# EAGLE design fsdr (EAGLE 6.3)

## Sheet 1 of 2
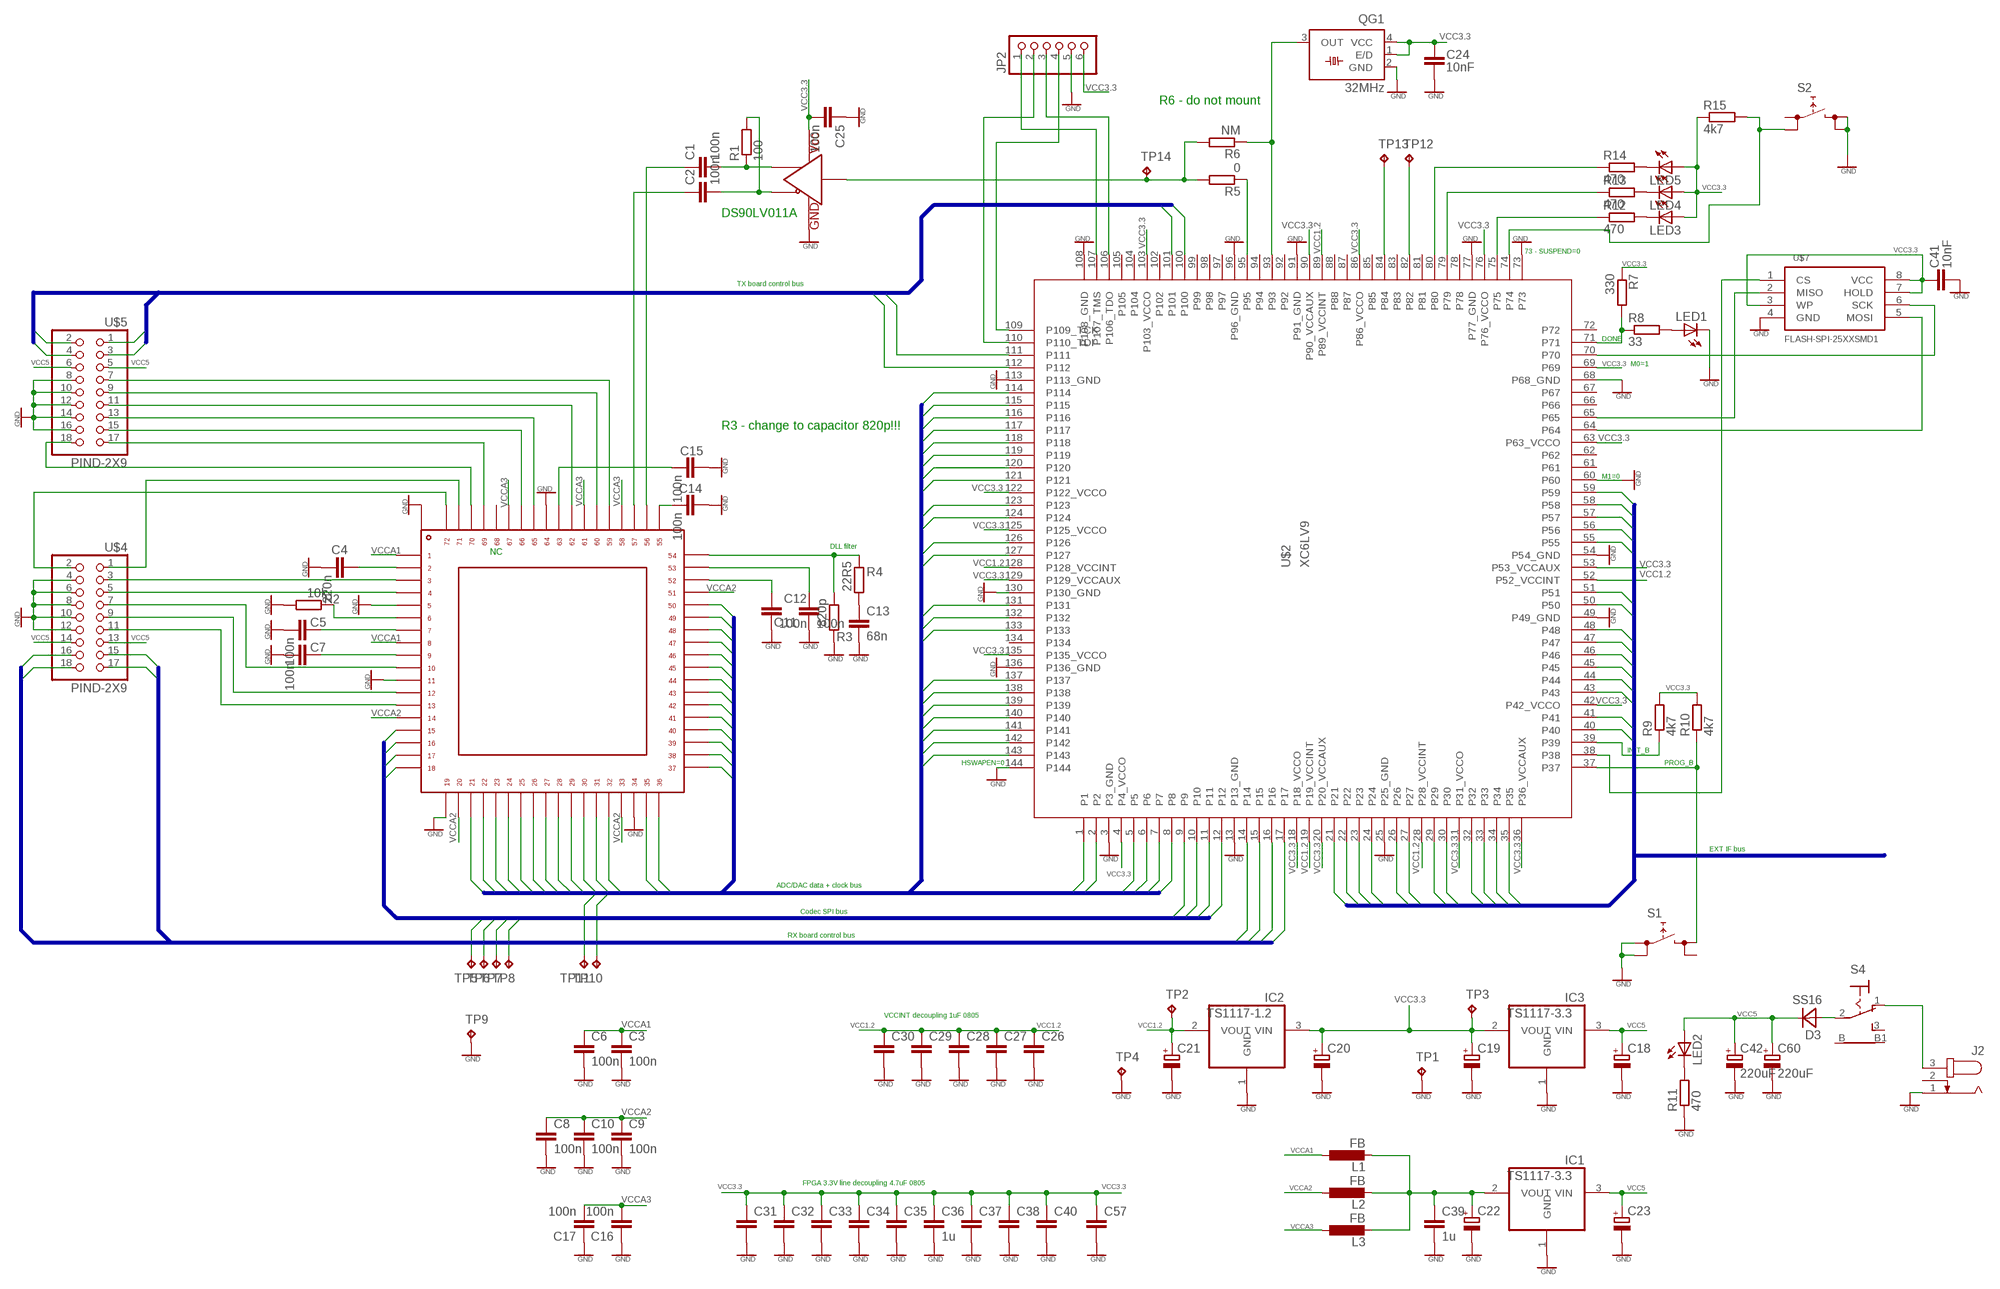
[diagram p0: schematic, sheet 1]

### Parts
C1  100n  C-EUC0402  [C0402]
C2  100n  C-EUC0402  [C0402]
C3  100n  C-EUC0402  [C0402]
C4  220n  C-EUC0402  [C0402]
C5  100n  C-EUC0402  [C0402]
C6  100n  C-EUC0402  [C0402]
C7  100n  C-EUC0402  [C0402]
C8  100n  C-EUC0402  [C0402]
C9  100n  C-EUC0402  [C0402]
C10  100n  C-EUC0402  [C0402]
C11  100n  C-EUC0402  [C0402]
C12  100n  C-EUC0402  [C0402]
C13  68n  C-EUC0402  [C0402]
C14  100n  C-EUC0402  [C0402]
C15  100n  C-EUC0402  [C0402]
C16  100n  C-EUC0402  [C0402]
C17  100n  C-EUC0402  [C0402]
C18  CPOL-EUSMCA  [SMC_A]
C19  CPOL-EUSMCA  [SMC_A]
C20  CPOL-EUSMCA  [SMC_A]
C21  CPOL-EUSMCA  [SMC_A]
C22  CPOL-EUSMCA  [SMC_A]
C23  CPOL-EUSMCA  [SMC_A]
C24  10nF  C-EUC0402  [C0402]
C25  100n  C-EUC0402  [C0402]
C26  C-EUC0805  [C0805]
C27  C-EUC0805  [C0805]
C28  C-EUC0805  [C0805]
C29  C-EUC0805  [C0805]
C30  C-EUC0805  [C0805]
C31  C-EUC0805  [C0805]
C32  C-EUC0805  [C0805]
C33  C-EUC0805  [C0805]
C34  C-EUC0805  [C0805]
C35  C-EUC0805  [C0805]
C36  1u  C-EUC0805  [C0805]
C37  C-EUC0805  [C0805]
C38  C-EUC0805  [C0805]
C39  1u  C-EUC0805  [C0805]
C40  C-EUC0805  [C0805]
C41  10nF  C-EUC0402  [C0402]
C42  220uF  CPOL-EUSMCD  [SMC_D]
C57  C-EUC0805  [C0805]
C60  220uF  CPOL-EUSMCD  [SMC_D]
D3  SS16  MBRA340T3  [SMA]
IC1  TS1117-3.3  REG1117  [SOT223]
IC2  TS1117-1.2  REG1117  [SOT223]
IC3  TS1117-3.3  REG1117  [SOT223]
J2  JACK-PLUG  [SPC4078-NOSLOT]
JP2  PINHD-1X6  [1X06]
L1  FB  EMI_FB-0603  [C0603]
L2  FB  EMI_FB-0603  [C0603]
L3  FB  EMI_FB-0603  [C0603]
LED1  LEDSML0805  [SML0805]
LED2  LEDSML0805  [SML0805]
LED3  LEDSML0805  [SML0805]
LED4  LEDSML0805  [SML0805]
LED5  LEDSML0805  [SML0805]
QG1  32MHz  SM77H  [SM77H]
R1  100  R-EU_R0402  [R0402]
R2  10k  R-EU_R0402  [R0402]
R3  820p  R-EU_R0402  [R0402]
R4  22R5  R-EU_R0402  [R0402]
R5  0  R-EU_R0402  [R0402]
R6  NM  R-EU_R0402  [R0402]
R7  330  R-EU_R0402  [R0402]
R8  33  R-EU_R0402  [R0402]
R9  4k7  R-EU_R0402  [R0402]
R10  4k7  R-EU_R0402  [R0402]
R11  470  R-EU_R0402  [R0402]
R12  470  R-EU_R0402  [R0402]
R13  470  R-EU_R0402  [R0402]
R14  470  R-EU_R0402  [R0402]
R15  4k7  R-EU_R0402  [R0402]
S1  SKHMPSE010  [SKHMPXE010]
S2  SKHMPSE010  [SKHMPXE010]
S4  9070-1W  [9070-1W]
TP1  TPPAD1-13  [P1-13]
TP2  TPPAD1-13  [P1-13]
TP3  TPPAD1-13  [P1-13]
TP4  TPPAD1-13  [P1-13]
TP5  TPB1,27  [B1,27]
TP6  TPB1,27  [B1,27]
TP7  TPB1,27  [B1,27]
TP8  TPB1,27  [B1,27]
TP9  TPB1,27  [B1,27]
TP10  TPB1,27  [B1,27]
TP11  TPB1,27  [B1,27]
TP12  TPB1,27  [B1,27]
TP13  TPB1,27  [B1,27]
TP14  TPB1,27  [B1,27]
U$1  AD9963  [LFCSP72]
U$2  XC6LV9  [TQFP144]
U$3  DS90LV011a  DS90LV011  [SOT23-5L]
U$4  PIND-2X9  [2X9SMD]
U$5  PIND-2X9  [2X9SMD]
U$7  FLASH-SPI-25XXSMD1  [SO08-EIAJ]

### Nets
CS: TP7.TP U$1.P$17 U$2.10
GND: C3.2 C4.2 C5.2 C6.2 C7.2 C8.2 C9.2 C10.2 C11.2 C12.2 C13.2 C14.1 C15.1 C16.1 C17.1 C18.- C19.- C20.- C21.- C22.- C23.- C24.1 C25.1 C26.2 C27.2 C28.2 C29.2 C30.2 C31.2 C32.2 C33.2 C34.2 C35.2 C36.2 C37.2 C38.2 C39.2 C40.2 C41.1 C42.- C57.2 C60.- IC1.1(GND) IC2.1(GND) IC3.1(GND) J2.1 JP2.5 LED1.C QG1.2(GND) R2.2 R3.2 R11.1 S1.1(1.1) S1.2(1.2) S2.3(2.1) S2.4(2.2) TP1.TP TP4.TP TP9.TP U$1.P$5 U$1.P$11 U$1.P$19 U$1.P$34 U$1.P$64 U$1.P$73_PAD U$2.3(P3_GND) U$2.13(P13_GND) U$2.25(P25_GND) U$2.49(P49_GND) U$2.54(P54_GND) U$2.60 U$2.68(P68_GND) U$2.73 U$2.77(P77_GND) U$2.91(P91_GND) U$2.96(P96_GND) U$2.108(P108_GND) U$2.113(P113_GND) U$2.130(P130_GND) U$2.136(P136_GND) U$2.144 U$3.2(GND) U$4.4 U$4.6 U$4.8 U$4.10 U$4.12 U$5.8 U$5.10 U$5.12 U$5.14 U$5.16 U$7.4(GND) ; also sheet 2
N$1: R7.2 R8.1 U$2.71
N$2: QG1.3(OUT) R6.1 U$2.93
N$3: LED1.A R8.2
N$4: JP2.1 U$2.107(P107_TMS)
N$5: JP2.3 U$2.106(P106_TDO)
N$6: JP2.4 U$2.109(P109_TCK)
N$7: JP2.2 U$2.110(P110_TDI)
N$8: R10.1 S1.3(2.1) U$2.37
N$9: U$1.P$3 U$4.3
N$10: U$1.P$4 U$4.5
N$11: U$1.P$10 U$4.7
N$12: U$1.P$12 U$4.9
N$13: C7.1 U$1.P$9
N$14: U$1.P$72 U$4.2
N$15: U$1.P$71 U$4.1
N$16: U$1.P$70 U$5.18
N$17: U$1.P$69 U$5.17
N$18: U$1.P$66 U$5.15
N$19: U$1.P$65 U$5.13
N$20: U$1.P$62 U$5.11
N$21: U$1.P$60 U$5.9
N$22: U$1.P$59 U$5.7
N$23: C1.2 R1.1 U$3.4(OUT)
N$24: C2.2 R1.2 U$3.3(/OUT)
N$25: C2.1 U$1.P$57
N$26: C13.1 R4.2
N$27: C1.1 U$1.P$56
N$28: R9.1 U$2.39
N$29: U$1.P$13 U$4.11
N$31: R2.1 U$1.P$6
N$32: C5.1 U$1.P$7
N$33: C4.1 U$1.P$2
N$34: C14.2 U$1.P$55
N$35: C15.2 U$1.P$63
N$36: R3.1 R4.1 U$1.P$54
N$37: C12.1 U$1.P$53
N$38: C11.1 U$1.P$52
N$39: R5.2 R6.2 TP14.TP U$3.5(IN)
N$41: R5.1 U$2.95
N$42: TP12.TP U$2.82
N$43: TP13.TP U$2.84
N$45: D3.A S4.2(P)
N$46: LED2.C R11.2
N$48: C22.+ C39.1 IC1.2(VOUT) L1.2 L2.2 L3.2
N$50: J2.3 S4.1(O)
N$51: U$2.38 U$7.1(CS)
N$53: U$2.64 U$7.5(MOSI)
N$54: U$2.70 U$7.6(SCK)
N$55: U$2.65 U$7.2(MISO)
N$56: R12.1 U$2.75
N$60: LED3.C R12.2
N$61: LED4.C R13.2
N$62: LED5.C R14.2
N$63: R13.1 U$2.79
N$65: R14.1 U$2.80
N$67: R15.2 S2.2(1.2) U$2.74
P14: U$2.14 U$4.16
P15: U$2.15 U$4.15
P16: U$2.16 U$4.18
P17: U$2.17 U$4.17
P21: U$2.21 ; also sheet 2
P22: U$2.22 ; also sheet 2
P23: U$2.23 ; also sheet 2
P24: U$2.24 ; also sheet 2
P26: U$2.26 ; also sheet 2
P27: U$2.27 ; also sheet 2
P29: U$2.29 ; also sheet 2
P30: U$2.30 ; also sheet 2
P32: U$2.32 ; also sheet 2
P33: U$2.33 ; also sheet 2
P34: U$2.34 ; also sheet 2
P35: U$2.35 ; also sheet 2
P40: U$2.40 ; also sheet 2
P41: U$2.41 ; also sheet 2
P43: U$2.43 ; also sheet 2
P44: U$2.44 ; also sheet 2
P45: U$2.45 ; also sheet 2
P46: U$2.46 ; also sheet 2
P47: U$2.47 ; also sheet 2
P48: U$2.48 ; also sheet 2
P50: U$2.50 ; also sheet 2
P51: U$2.51 ; also sheet 2
P55: U$2.55 ; also sheet 2
P56: U$2.56 ; also sheet 2
P57: U$2.57 ; also sheet 2
P58: U$2.58 ; also sheet 2
P59: U$2.59 ; also sheet 2
P100: U$2.100 U$5.2
P101: U$2.101 U$5.1
P111: U$2.111 U$5.4
P112: U$2.112 U$5.3
RES: TP5.TP U$1.P$15 U$2.12
SCK: TP6.TP U$1.P$16 U$2.11
SD: TP8.TP U$1.P$18 U$2.9
TRXCLK: TP11.TP U$1.P$36 U$2.133
TRXD0: U$1.P$32 U$2.138
TRXD1: U$1.P$31 U$2.139
TRXD2: U$1.P$30 U$2.140
TRXD3: U$1.P$29 U$2.141
TRXD4: U$1.P$28 U$2.142
TRXD5: U$1.P$27 U$2.143
TRXD6: U$1.P$26 U$2.1
TRXD7: U$1.P$25 U$2.2
TRXD8: U$1.P$24 U$2.5
TRXD9: U$1.P$23 U$2.6
TRXD10: U$1.P$22 U$2.7
TRXD11: U$1.P$21 U$2.8
TRXIQ: U$1.P$35 U$2.137
TXCLK: TP10.TP U$1.P$37 U$2.132
TXD0: U$1.P$50 U$2.114
TXD1: U$1.P$49 U$2.115
TXD2: U$1.P$48 U$2.116
TXD3: U$1.P$47 U$2.117
TXD4: U$1.P$46 U$2.118
TXD5: U$1.P$45 U$2.119
TXD6: U$1.P$44 U$2.120
TXD7: U$1.P$43 U$2.121
TXD8: U$1.P$42 U$2.123
TXD9: U$1.P$41 U$2.124
TXD10: U$1.P$40 U$2.126
TXD11: U$1.P$39 U$2.127
TXIQ: U$1.P$38 U$2.131
VCC1.2: C21.+ C26.1 C27.1 C28.1 C29.1 C30.1 IC2.2(VOUT) TP2.TP U$2.19(P19_VCCINT) U$2.28(P28_VCCINT) U$2.52(P52_VCCINT) U$2.89(P89_VCCINT) U$2.128(P128_VCCINT)
VCC3.3: C19.+ C20.+ C24.2 C25.2 C31.1 C32.1 C33.1 C34.1 C35.1 C36.1 C37.1 C38.1 C40.1 C41.2 C57.1 IC2.3(VIN) IC3.2(VOUT) JP2.6 LED3.A LED4.A LED5.A QG1.1(E/D) QG1.4(VCC) R7.1 R9.2 R10.2 R15.1 TP3.TP U$2.4(P4_VCCO) U$2.18(P18_VCCO) U$2.20(P20_VCCAUX) U$2.31(P31_VCCO) U$2.36(P36_VCCAUX) U$2.42(P42_VCCO) U$2.53(P53_VCCAUX) U$2.63(P63_VCCO) U$2.69 U$2.76(P76_VCCO) U$2.86(P86_VCCO) U$2.90(P90_VCCAUX) U$2.103(P103_VCCO) U$2.122(P122_VCCO) U$2.125(P125_VCCO) U$2.129(P129_VCCAUX) U$2.135(P135_VCCO) U$3.1(VCC) U$7.3(WP) U$7.7(HOLD) U$7.8(VCC)
VCC5: C18.+ C23.+ C42.+ C60.+ D3.C IC1.3(VIN) IC3.3(VIN) LED2.A U$4.13 U$4.14 U$5.5 U$5.6 ; also sheet 2
VCCA1: C3.1 C6.1 L1.1 U$1.P$1 U$1.P$8
VCCA2: C8.1 C9.1 C10.1 L2.1 U$1.P$14 U$1.P$20 U$1.P$33 U$1.P$51
VCCA3: C16.2 C17.2 L3.1 U$1.P$58 U$1.P$61 U$1.P$67
Unconnected: J2.2 S1.4(2.2) S2.1(1.1) S4.3(S) S4.B S4.B1 U$1.P$68 U$2.62 U$2.66 U$2.67 U$2.72 U$2.78 U$2.81 U$2.83 U$2.87 U$2.92 U$2.94 U$2.97 U$2.99 U$2.102 U$2.104 U$2.105 U$2.134

### Buses
RES,SCK,CS,SD
TRXD[0..11],TRXCLK,TRXIQ,TXD[0..11],TXIQ,TXCLK
P[21..24],P26,P27,P29,P30,P[32..35],P40,P41,P[43..48],P50,P51,P[55..59]
P[14..17]
P101,P100,P111,P112

### Notes on the sheet
- R6 - do not mount
- DS90LV011A
- 73 - SUSPEND=0
- TX board control bus
- DONE
- M0=1
- R3 - change to capacitor 820p!!!
- M1=0
- NC | DLL filter
- INIT_B
- HSWAPEN=0 | PROG_B
- EXT IF bus
- ADC/DAC data + clock bus
- Codec SPI bus
- RX board control bus
- VCCINT decoupling 1uF 0805
- FPGA 3.3V line decoupling 4.7uF 0805

## Sheet 2 of 2
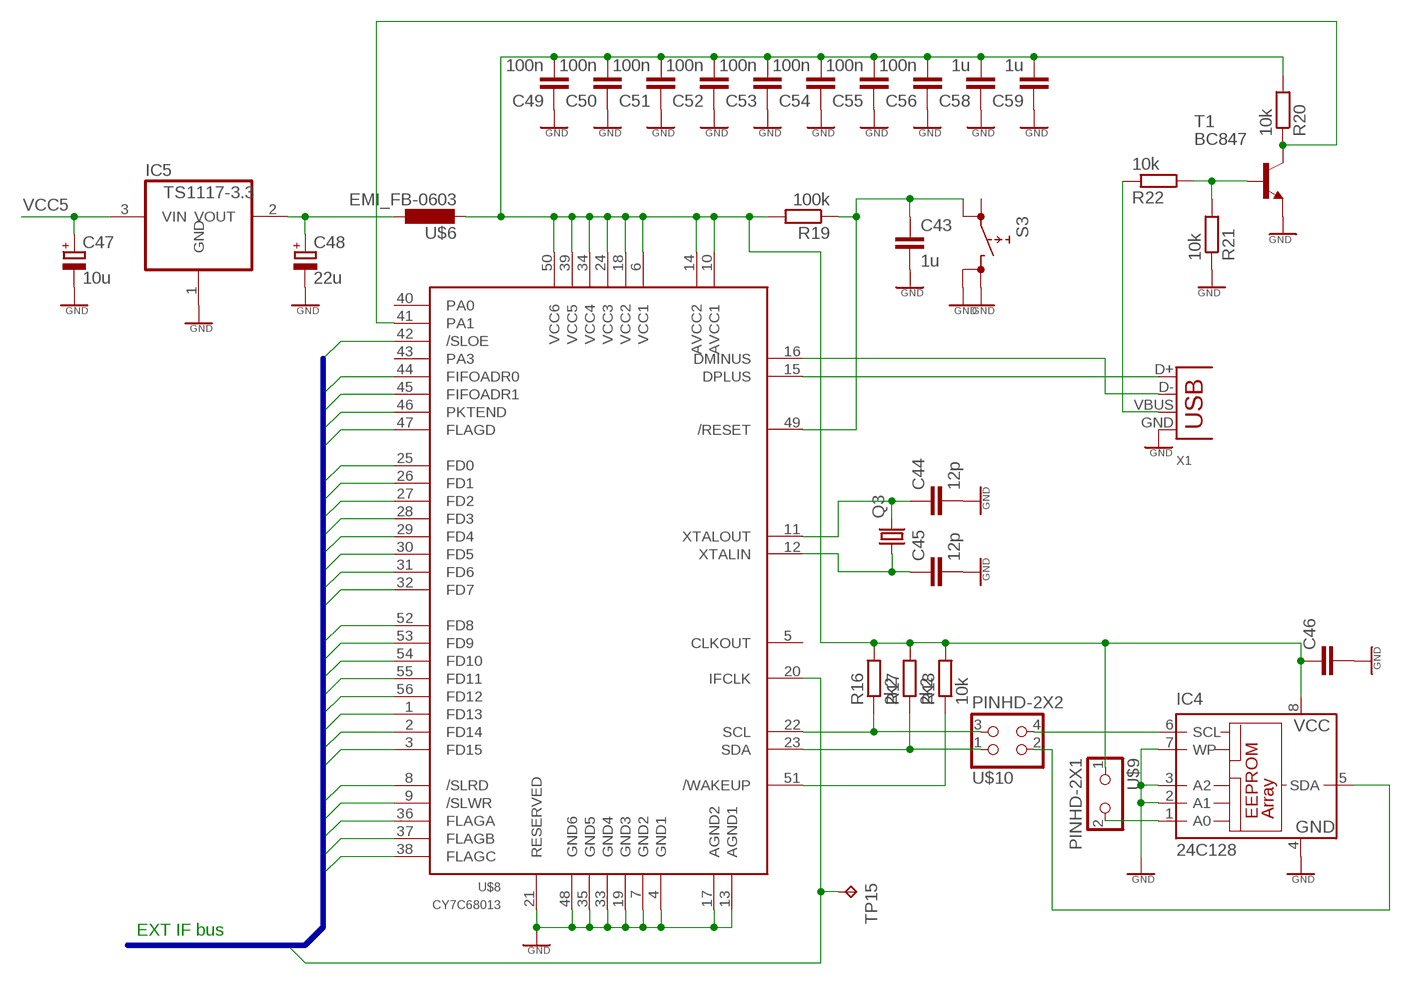
[diagram p1: schematic, sheet 2]

### Parts
C43  1u  C-EUC0402  [C0402]
C44  12p  C-EUC0402  [C0402]
C45  12p  C-EUC0402  [C0402]
C46  C-EUC0402  [C0402]
C47  10u  CPOL-EUSMCA  [SMC_A]
C48  22u  CPOL-EUSMCA  [SMC_A]
C49  100n  C-EUC0402  [C0402]
C50  100n  C-EUC0402  [C0402]
C51  100n  C-EUC0402  [C0402]
C52  100n  C-EUC0402  [C0402]
C53  100n  C-EUC0402  [C0402]
C54  100n  C-EUC0402  [C0402]
C55  100n  C-EUC0402  [C0402]
C56  100n  C-EUC0402  [C0402]
C58  1u  C-EUC0402  [C0402]
C59  1u  C-EUC0402  [C0402]
IC4  24C128  24C16BSN  [SO-08]
IC5  TS1117-3.3  REG1117  [SOT223]
Q3  CRYSTALHC49U-V  [HC49U-V]
R16  2k2  R-EU_R0402  [R0402]
R17  2k2  R-EU_R0402  [R0402]
R18  10k  R-EU_R0402  [R0402]
R19  100k  R-EU_R0402  [R0402]
R20  10k  R-EU_R0402  [R0402]
R21  10k  R-EU_R0402  [R0402]
R22  10k  R-EU_R0402  [R0402]
S3  SKHMPSE010  [SKHMPXE010]
T1  BC847  [SOT23]
TP15  TPB1,27  [B1,27]
U$6  EMI_FB-0603  [C0603]
U$8  CY7C68013  [56-SSOP]
U$9  PINHD-2X1  [2X1SMD]
U$10  PINHD-2X2  [2X2SMD]
X1  USB-MB-S  [USB-MB-S]

### Nets
GND: C43.2 C44.2 C45.2 C46.2 C47.- C48.- C49.1 C50.1 C51.1 C52.1 C53.1 C54.1 C55.1 C56.1 C58.1 C59.1 IC4.2(A1) IC4.3(A2) IC4.4(GND) IC4.7(WP) IC5.1(GND) R21.1 S3.3(2.1) S3.4(2.2) T1.2(E) U$8.4(GND1) U$8.7(GND2) U$8.13(AGND1) U$8.17(AGND2) U$8.19(GND3) U$8.21(RESERVED) U$8.33(GND4) U$8.35(GND5) U$8.48(GND6) X1.GND ; also sheet 1
N$47: U$8.15(DPLUS) X1.D+
N$49: U$8.16(DMINUS) X1.D-
N$52: C43.1 R19.1 S3.2(1.2) U$8.49(/RESET)
N$57: R16.1 U$8.22(SCL) U$10.3
N$58: IC4.5(SDA) U$10.2
N$59: R18.1 U$8.51(/WAKEUP)
N$64: C44.1 Q3.2 U$8.11(XTALOUT)
N$66: C45.1 Q3.1 U$8.12(XTALIN)
N$68: C46.1 C49.2 C50.2 C51.2 C52.2 C53.2 C54.2 C55.2 C56.2 C58.2 C59.2 IC4.8(VCC) R16.2 R17.2 R18.2 R19.2 R20.2 U$6.2 U$8.6(VCC1) U$8.10(AVCC1) U$8.14(AVCC2) U$8.18(VCC2) U$8.24(VCC3) U$8.34(VCC4) U$8.39(VCC5) U$8.50(VCC6) U$9.1
N$69: IC4.1(A0) U$9.2
N$70: C48.+ IC5.2(VOUT) U$6.1
N$71: R22.1 X1.VBUS
N$72: R17.1 U$8.23(SDA) U$10.1
N$73: IC4.6(SCL) U$10.4
N$74: R20.1 T1.3(C) U$8.41(PA1)
N$75: R21.2 R22.2 T1.1(B)
P21: U$8.56(FD12) ; also sheet 1
P22: U$8.55(FD11) ; also sheet 1
P23: U$8.54(FD10) ; also sheet 1
P24: U$8.53(FD9) ; also sheet 1
P26: U$8.52(FD8) ; also sheet 1
P27: U$8.47(FLAGD) ; also sheet 1
P29: U$8.46(PKTEND) ; also sheet 1
P30: U$8.45(FIFOADR1) ; also sheet 1
P32: U$8.44(FIFOADR0) ; also sheet 1
P33: U$8.42(/SLOE) ; also sheet 1
P34: U$8.38(FLAGC) ; also sheet 1
P35: U$8.37(FLAGB) ; also sheet 1
P40: U$8.29(FD4) ; also sheet 1
P41: U$8.30(FD5) ; also sheet 1
P43: U$8.31(FD6) ; also sheet 1
P44: U$8.32(FD7) ; also sheet 1
P45: U$8.36(FLAGA) ; also sheet 1
P46: U$8.27(FD2) ; also sheet 1
P47: U$8.28(FD3) ; also sheet 1
P48: U$8.26(FD1) ; also sheet 1
P50: U$8.25(FD0) ; also sheet 1
P51: TP15.TP U$8.20(IFCLK) ; also sheet 1
P55: U$8.9(/SLWR) ; also sheet 1
P56: U$8.8(/SLRD) ; also sheet 1
P57: U$8.3(FD15) ; also sheet 1
P58: U$8.2(FD14) ; also sheet 1
P59: U$8.1(FD13) ; also sheet 1
VCC5: C47.+ IC5.3(VIN) ; also sheet 1
Unconnected: S3.1(1.1) U$8.5(CLKOUT) U$8.40(PA0) U$8.43(PA3)

### Buses
P[21..24],P26,P27,P29,P30,P[32..35],P40,P41,P[43..48],P50,P51,P[55..59]

### Notes on the sheet
- EXT IF bus

## Power pins joined to a net without a drawn wire
P61: U$2.61
P85: U$2.85
P88: U$2.88
P98: U$2.98

## Library data of the parts
C1-C17 C24-C41 C43-C46 C49-C59 = rcl:C-EU: CAPACITOR, European symbol
C18-C23 C42 C47 C48 C60 = rcl:CPOL-EU: POLARIZED CAPACITOR, European symbol
D3 = diode:MBRA340T3: Surface Mount Schottky Power Rectifier Source: http://www.onsemi.com/pub_link/Collateral/MBRA340T3-D.PDF
IC1-IC3 IC5 = burr-brown:REG1117: 800mA and 1A Low Dropout (LDO) Positive Regulator 1.8V, 2.5V, 2.85V, 3.3V, 5V, and Adj; MPN: REG1117; OC_FARNELL: 1097566; OC_NEWARK: 14P6981
IC4 = microchip:24*: Serial EEPROM I2C; MPN: AT24C16BN-SH-B; OC_FARNELL: 1362651; OC_NEWARK: 50M3324
J2 = GadgetFactory:JACK-PLUG: DC POWER JACK Power Jack, DC, Right Angle, Through Hole, Rated 5A at 16VDC, PC Terminals Distributor: Farnell (www.Farnell.de) Drawing: 84N1161.pdf / 84N1162.pdf Manufacturer: SPC Technology (www.spctechnology.com) Type: SPC4077 / SPC 4078
JP2 = pinhead:PINHD-1X6: PIN HEADER
L1-L3 U$6 = emi_fb:EMI_FB-0603
LED1-LED5 = led:LED: LED OSRAM: - CHIPLED LG R971, LG N971, LY N971, LG Q971, LY Q971, LO R971, LY R971 LH N974, LH R974 LS Q976, LO Q976, LY Q976 LO Q996 - Hyper CHIPLED LW Q18S LB Q993, LB Q99A, LB R99A - SideLED LS A670, LO A670, LY A670, LG A670, LP A670 LB A673, LV A673, LT A673, LW A673 LH A674 LY A675 LS A676, LA A676, LO A676, LY A676, LW A676 LS A679, LY A679, LG A679 - Hyper Micro SIDELED® LS Y876, LA Y876, LO Y876, LY Y876 LT Y87S - SmartLED LW L88C, LW L88S LB L89C, LB L89S, LG L890 LS L89K, LO L89K, LY L89K LS L896, LA L896, LO L896, LY L896 - TOPLED LS T670, LO T670, LY T670, LG T670, LP T670 LSG T670, LSP T670, LSY T670, LOP T670, LYG T670 LG T671, LOG T671, LSG T671 LB T673, LV T673, LT T673, LW T673 LH T674 LS T676, LA T676, LO T676, LY T676, LB T676, LH T676, LSB T676, LW T676 LB T67C, LV T67C, LT T67C, LS T67K, LO T67K, LY T67K, LW E67C LS E67B, LA E67B, LO E67B, LY E67B, LB E67C, LV E67C, LT E67C LW T67C LS T679, LY T679, LG T679 LS T770, LO T770, LY T770, LG T770, LP T770 LB T773, LV T773, LT T773, LW T773 LH T774 LS E675, LA E675, LY E675, LS T675 LS T776, LA T776, LO T776, LY T776, LB T776 LHGB T686 LT T68C, LB T68C - Hyper Mini TOPLED® LB M676 - Mini TOPLED Santana® LG M470 LS M47K, LO M47K, LY M47K Source: http://www.osram.convergy.de LUXEON: - LUMILED® LXK2-PW12-R00, LXK2-PW12-S00, LXK2-PW14-U00, LXK2-PW14-V00 LXK2-PM12-R00, LXK2-PM12-S00, LXK2-PM14-U00 LXK2-PE12-Q00, LXK2-PE12-R00, LXK2-PE12-S00, LXK2-PE14-T00, LXK2-PE14-U00 LXK2-PB12-K00, LXK2-PB12-L00, LXK2-PB12-M00, LXK2-PB14-N00, LXK2-PB14-P00, LXK2-PB14-Q00 LXK2-PR12-L00, LXK2-PR12-M00, LXK2-PR14-Q00, LXK2-PR14-R00 LXK2-PD12-Q00, LXK2-PD12-R00, LXK2-PD12-S00 LXK2-PH12-R00, LXK2-PH12-S00 LXK2-PL12-P00, LXK2-PL12-Q00, LXK2-PL12-R00 Source: www.luxeon.com KINGBRIGHT: KA-3528ASYC Source: www.kingbright.com
Q3 = crystal:CRYSTAL: CRYSTAL; OC_FARNELL: 1666969; OC_NEWARK: unknown
QG1 = crystal:SM77H: 3.3V CMOS Clock Oscillator Source: www.pletronics.com .. sm77h%203.3v.pdf; OC_FARNELL: unknown; OC_NEWARK: unknown
R1-R22 = rcl:R-EU_: RESISTOR, European symbol
S1-S3 = switch:SKHMP*E010: 6.2 X 6.5mm TACT Switch (SMD) Source: http://www3.alps.co.jp/WebObjects/catalog.woa/PDF/E/Switch/Tact/SKHM/SKHM.PDF
S4 = switch:9070-1W: TOGGLE SWITCH Marquardt
T1 = transistor:BC847: NPN TRANSISTOR
TP1-TP15 = testpad:TP: Test pad
U$1 = ad9963:AD9963
U$2 = spartan6:XC6LV9
U$3 = ds90lv011a:DS90LV011
U$4 U$5 = pinhead_2mm:PIND-2X9
U$7 = GadgetFactory:FLASH-SPI-25XX: SPI Flash
U$8 = cy7c68013:CY7C68013
U$9 = pinhead_2mm:PINHD-2X1
U$10 = pinhead_2mm:PINHD-2X2
X1 = con-usb-3:USB: USB Connectors

## Board
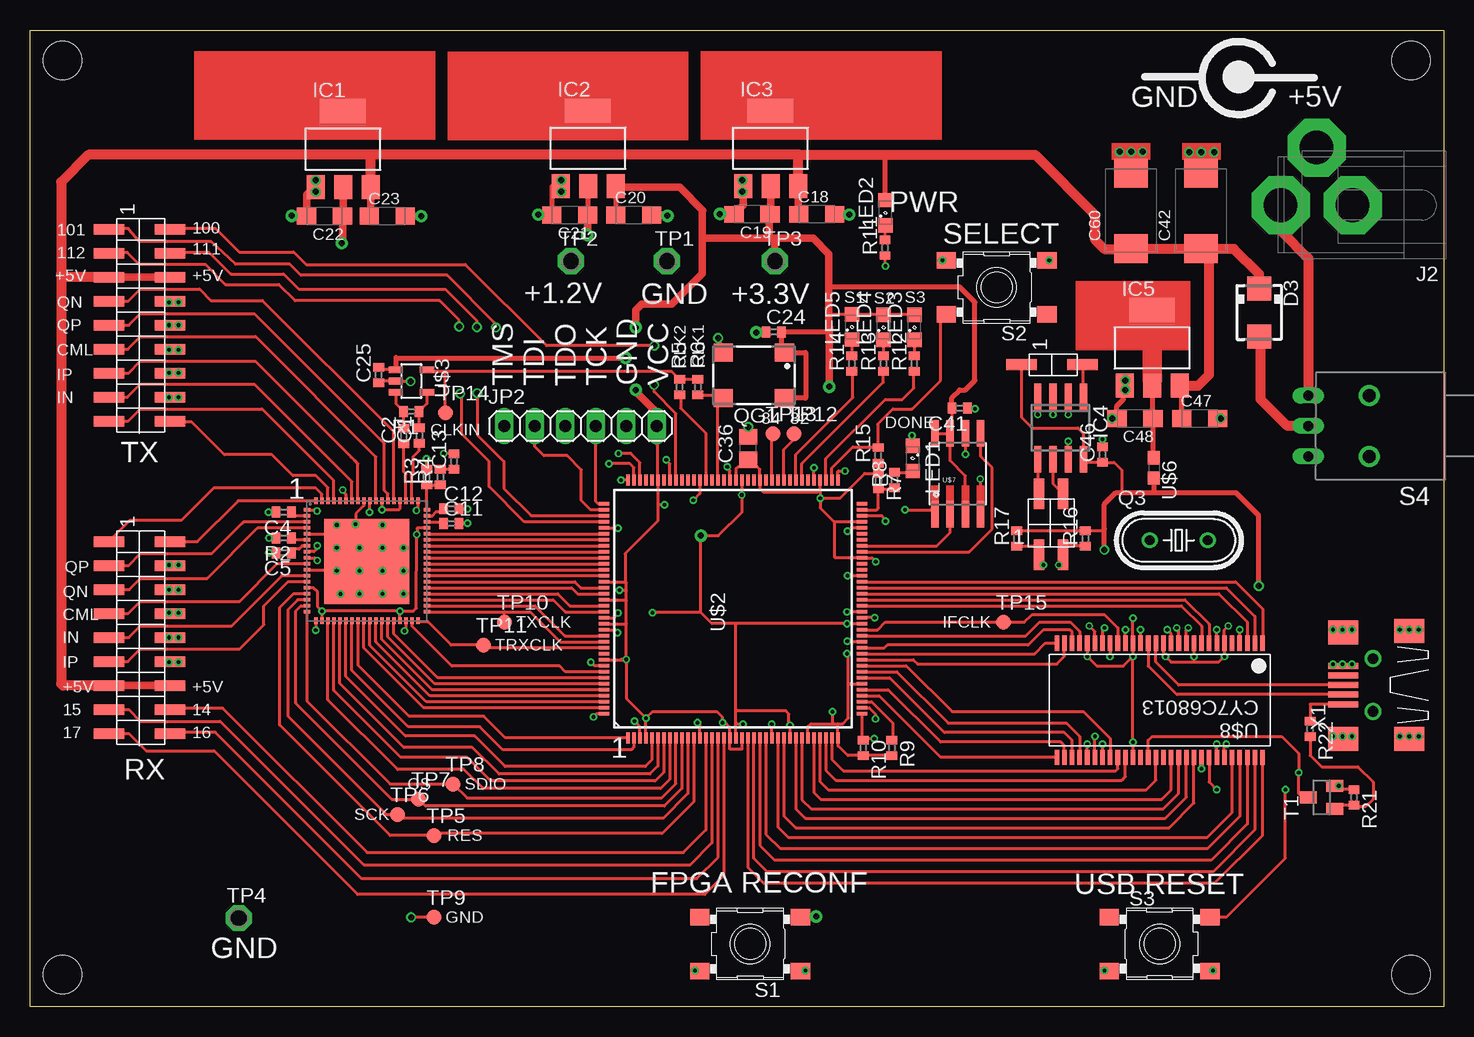
[diagram p2: board, top side]
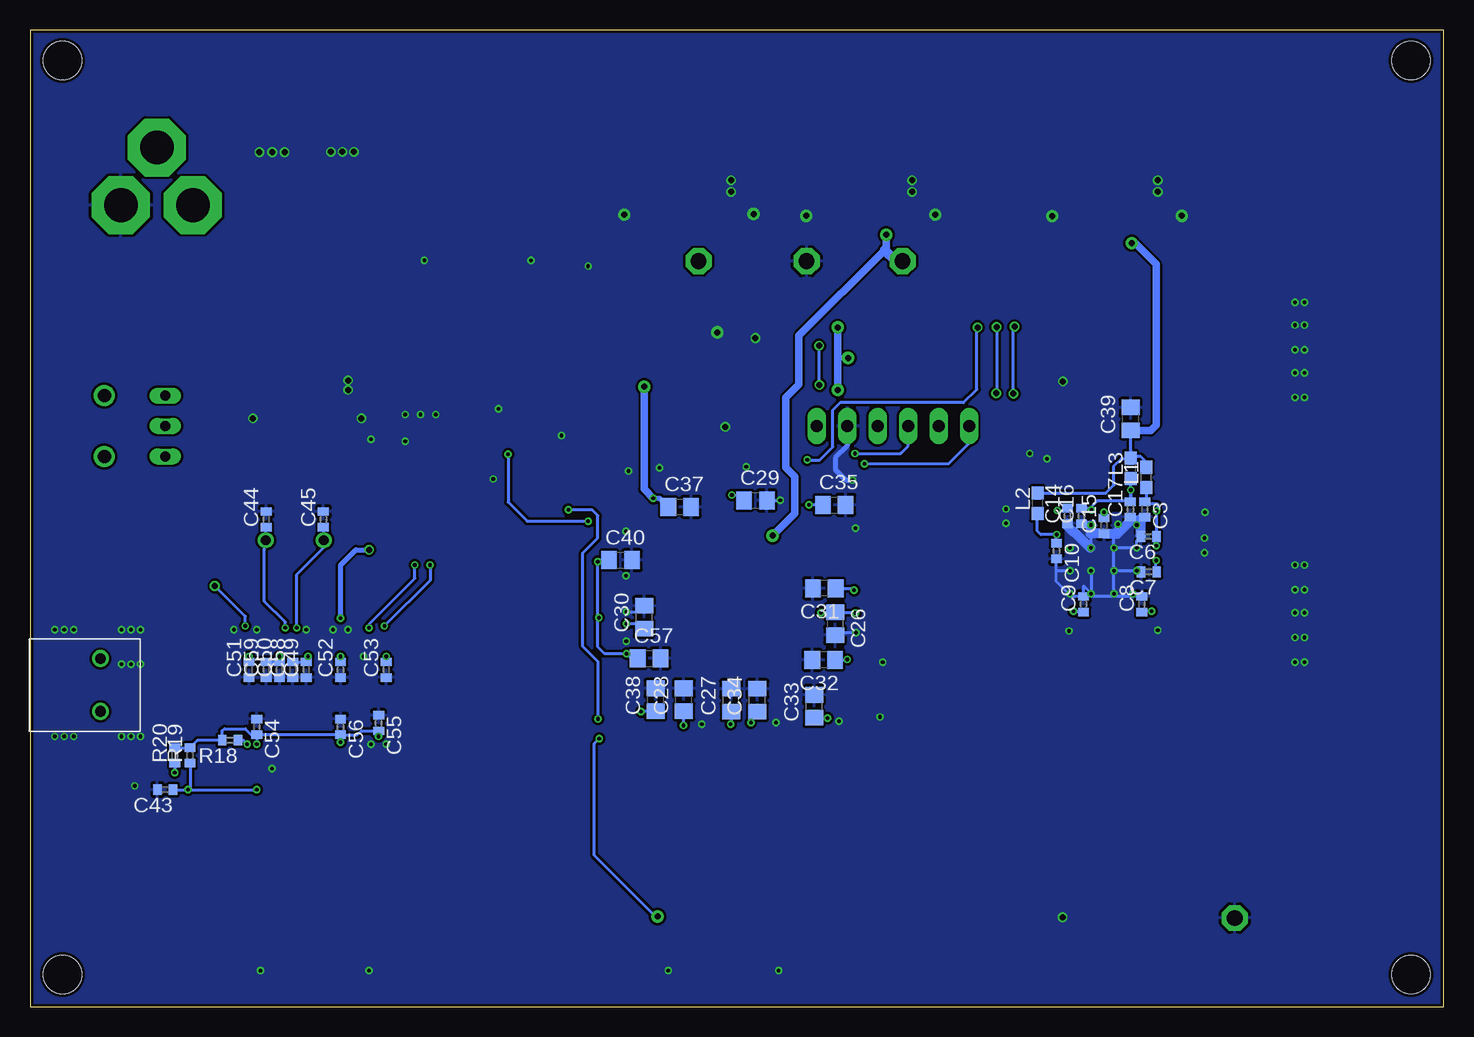
[diagram p3: board, bottom side, seen from below]

Size 117.79 x 81.44 mm. Coordinates in mm from the lower left corner, seen from the top.
Outline: 0,81.44 117.79,81.44 117.79,0 0,0 0,81.44
Copper layers (1*16): Top 0.035mm / dielectric 1.5mm / Bottom 0.035mm
Design rules "do_produkcji": minimum track width 6mil, minimum drill 12mil, track to track 8mil, track to pad 8mil, pad to pad 8mil, via to via 8mil, smd to smd 8mil, copper to edge 10mil, drill to drill 10mil, minimum pad ring 10mil, minimum via ring 6mil, stop-mask expansion 2mil, vias tented up to drill 100mil, thermal gap 10mil
Holes 3.2 mm at 115.09,78.9 115.09,2.7 2.7,2.7 2.7,78.9
bRestrict: area 26.7,41.3 to 28.1,41.9; area 31.6,37.8 to 31.9,40; area 31.9,39.7 to 33.5,43.3; area 24.1,39.7 to 24.8,40.3; area 28.9,40.6 to 29.5,41.1

### Footprints (pad centres in the part's own frame; a part is rotated, then mirrored left to right if it is on the bottom)
C0402 = smd 0.7 x 0.9: 1 -0.65,0; 2 0.65,0
SMC_A = smd 1.6 x 1.4: + -1.5,0; - 1.5,0
C0805 = smd 1.3 x 1.5: 1 -0.95,0; 2 0.95,0
SMC_D = smd 2.4 x 2.8: + -3.15,0; - 3.15,0
SMA = smd 2 x 2: A 2,0; C -2,0
SOT223 = smd 1.499 x 2.007: 1 -2.261,-3.15; 2 0.025,-3.15; 3 2.311,-3.15 | smd 3.81 x 2.007: 4 0,3.15
SO-08 = smd 0.6 x 2.2: 1 -1.905,-2.6; 2 -0.635,-2.6; 3 0.635,-2.6; 4 1.905,-2.6; 5 1.905,2.6; 6 0.635,2.6; 7 -0.635,2.6; 8 -1.905,2.6
SPC4078-NOSLOT = drill 2.8 pad 4.826 octagon: 1 -3,0; 2 0,-4.8; 3 3,0
1X06 = drill 1.016 long: 1 -6.35,0; 2 -3.81,0; 3 -1.27,0; 4 1.27,0; 5 3.81,0; 6 6.35,0
C0603 = smd 1.1 x 1: 1 -0.85,0; 2 0.85,0
SML0805 = smd 1.2 x 1.2: A 1.05,0; C -1.05,0
HC49U-V = drill 0.813: 1 -2.413,0; 2 2.413,0
SM77H = smd 1.6 x 1.5: 1 -2.55,-1.9; 2 2.55,-1.9; 3 2.55,1.9; 4 -2.55,1.9
R0402 = smd 0.7 x 0.9: 1 -0.65,0; 2 0.65,0
SKHMPXE010 = smd 1.6 x 1.4: 1 -4.2,2.25; 2 4.2,2.25; 3 -4.2,-2.25; 4 4.2,-2.25
9070-1W = drill 0.813 long: 1 5.08,-2.54; 2 5.08,0; 3 5.08,2.54 | drill 1.118 pad 1.778: B 0,-2.54; B1 0,2.54
SOT23 = smd 1 x 1.4: 1 -0.95,-1.1; 2 0.95,-1.1; 3 0,1.1
P1-13 = drill 1.321 pad 2.159 octagon: TP 0,0
B1,27 = smd 1.27 x 1.27: TP 0,0
LFCSP72 = smd 0.55 x 0.3: P$1 -5.07,4.38; P$2 -5.07,3.88; P$3 -5.07,3.38; P$4 -5.07,2.88; P$5 -5.07,2.38; P$6 -5.07,1.88; P$7 -5.07,1.38; P$8 -5.07,0.88; P$9 -5.07,0.38; P$10 -5.07,-0.12; P$11 -5.07,-0.62; P$12 -5.07,-1.12; P$13 -5.07,-1.62; P$14 -5.07,-2.12; P$15 -5.07,-2.62; P$16 -5.07,-3.12; P$17 -5.07,-3.62; P$18 -5.07,-4.12; P$37 4.93,-4.12; P$38 4.93,-3.62; P$39 4.93,-3.12; P$40 4.93,-2.62; P$41 4.93,-2.12; P$42 4.93,-1.62; P$43 4.93,-1.12; P$44 4.93,-0.62; P$45 4.93,-0.12; P$46 4.93,0.38; P$47 4.93,0.88; P$48 4.93,1.38; P$49 4.93,1.88; P$50 4.93,2.38; P$51 4.93,2.88; P$52 4.93,3.38; P$53 4.93,3.88; P$54 4.93,4.38 | smd 0.3 x 0.55: P$19 -4.33,-4.88; P$20 -3.83,-4.88; P$21 -3.33,-4.88; P$22 -2.83,-4.88; P$23 -2.33,-4.88; P$24 -1.83,-4.88; P$25 -1.33,-4.88; P$26 -0.83,-4.88; P$27 -0.33,-4.88; P$28 0.17,-4.88; P$29 0.67,-4.88; P$30 1.17,-4.88; P$31 1.67,-4.88; P$32 2.17,-4.88; P$33 2.67,-4.88; P$34 3.17,-4.88; P$35 3.67,-4.88; P$36 4.17,-4.88; P$55 4.17,5.12; P$56 3.67,5.12; P$57 3.17,5.12; P$58 2.67,5.12; P$59 2.17,5.12; P$60 1.67,5.12; P$61 1.17,5.12; P$62 0.67,5.12; P$63 0.17,5.12; P$64 -0.33,5.12; P$65 -0.83,5.12; P$66 -1.33,5.12; P$67 -1.83,5.12; P$68 -2.33,5.12; P$69 -2.83,5.12; P$70 -3.33,5.12; P$71 -3.83,5.12; P$72 -4.33,5.12 | smd 7.1 x 7.1: P$73_PAD -0.09,0.07
TQFP144 = smd 0.9 x 0.3: 1 -10.75,8.75; 2 -10.75,8.25; 3 -10.75,7.75; 4 -10.75,7.25; 5 -10.75,6.75; 6 -10.75,6.25; 7 -10.75,5.75; 8 -10.75,5.25; 9 -10.75,4.75; 10 -10.75,4.25; 11 -10.75,3.75; 12 -10.75,3.25; 13 -10.75,2.75; 14 -10.75,2.25; 15 -10.75,1.75; 16 -10.75,1.25; 17 -10.75,0.75; 18 -10.75,0.25; 19 -10.75,-0.25; 20 -10.75,-0.75; 21 -10.75,-1.25; 22 -10.75,-1.75; 23 -10.75,-2.25; 24 -10.75,-2.75; 25 -10.75,-3.25; 26 -10.75,-3.75; 27 -10.75,-4.25; 28 -10.75,-4.75; 29 -10.75,-5.25; 30 -10.75,-5.75; 31 -10.75,-6.25; 32 -10.75,-6.75; 33 -10.75,-7.25; 34 -10.75,-7.75; 35 -10.75,-8.25; 36 -10.75,-8.75; 73 10.75,-8.75; 74 10.75,-8.25; 75 10.75,-7.75; 76 10.75,-7.25; 77 10.75,-6.75; 78 10.75,-6.25; 79 10.75,-5.75; 80 10.75,-5.25; 81 10.75,-4.75; 82 10.75,-4.25; 83 10.75,-3.75; 84 10.75,-3.25; 85 10.75,-2.75; 86 10.75,-2.25; 87 10.75,-1.75; 88 10.75,-1.25; 89 10.75,-0.75; 90 10.75,-0.25; 91 10.75,0.25; 92 10.75,0.75; 93 10.75,1.25; 94 10.75,1.75; 95 10.75,2.25; 96 10.75,2.75; 97 10.75,3.25; 98 10.75,3.75; 99 10.75,4.25; 100 10.75,4.75; 101 10.75,5.25; 102 10.75,5.75; 103 10.75,6.25; 104 10.75,6.75; 105 10.75,7.25; 106 10.75,7.75; 107 10.75,8.25; 108 10.75,8.75 | smd 0.3 x 0.9: 37 -8.75,-10.75; 38 -8.25,-10.75; 39 -7.75,-10.75; 40 -7.25,-10.75; 41 -6.75,-10.75; 42 -6.25,-10.75; 43 -5.75,-10.75; 44 -5.25,-10.75; 45 -4.75,-10.75; 46 -4.25,-10.75; 47 -3.75,-10.75; 48 -3.25,-10.75; 49 -2.75,-10.75; 50 -2.25,-10.75; 51 -1.75,-10.75; 52 -1.25,-10.75; 53 -0.75,-10.75; 54 -0.25,-10.75; 55 0.25,-10.75; 56 0.75,-10.75; 57 1.25,-10.75; 58 1.75,-10.75; 59 2.25,-10.75; 60 2.75,-10.75; 61 3.25,-10.75; 62 3.75,-10.75; 63 4.25,-10.75; 64 4.75,-10.75; 65 5.25,-10.75; 66 5.75,-10.75; 67 6.25,-10.75; 68 6.75,-10.75; 69 7.25,-10.75; 70 7.75,-10.75; 71 8.25,-10.75; 72 8.75,-10.75; 109 8.75,10.75; 110 8.25,10.75; 111 7.75,10.75; 112 7.25,10.75; 113 6.75,10.75; 114 6.25,10.75; 115 5.75,10.75; 116 5.25,10.75; 117 4.75,10.75; 118 4.25,10.75; 119 3.75,10.75; 120 3.25,10.75; 121 2.75,10.75; 122 2.25,10.75; 123 1.75,10.75; 124 1.25,10.75; 125 0.75,10.75; 126 0.25,10.75; 127 -0.25,10.75; 128 -0.75,10.75; 129 -1.25,10.75; 130 -1.75,10.75; 131 -2.25,10.75; 132 -2.75,10.75; 133 -3.25,10.75; 134 -3.75,10.75; 135 -4.25,10.75; 136 -4.75,10.75; 137 -5.25,10.75; 138 -5.75,10.75; 139 -6.25,10.75; 140 -6.75,10.75; 141 -7.25,10.75; 142 -7.75,10.75; 143 -8.25,10.75; 144 -8.75,10.75
SOT23-5L = smd 0.55 x 1.2: 1 -0.95,-1.3; 2 0,-1.3; 3 0.95,-1.3; 4 0.95,1.3; 5 -0.95,1.3
2X9SMD = smd 0.89 x 2.54: 1 -7.67,-3.11; 2 -7.67,1.97; 3 -5.67,-3.11; 4 -5.67,1.97; 5 -3.67,-3.11; 6 -3.67,1.97; 7 -1.67,-3.11; 8 -1.67,1.97; 9 0.33,-3.11; 10 0.33,1.97; 11 2.33,-3.11; 12 2.33,1.97; 13 4.33,-3.11; 14 4.33,1.97; 15 6.33,-3.11; 16 6.33,1.97; 17 8.33,-3.11; 18 8.33,1.97
SO08-EIAJ = smd 0.61 x 2.21: 1 -1.905,-3.378; 2 -0.635,-3.378; 3 0.635,-3.378; 4 1.905,-3.378; 5 1.905,3.353; 6 0.635,3.353; 7 -0.635,3.353; 8 -1.905,3.353
56-SSOP = smd 1.27 x 0.381: 1 -4.763,8.572; 2 -4.763,7.938; 3 -4.763,7.303; 4 -4.763,6.668; 5 -4.763,6.032; 6 -4.763,5.397; 7 -4.763,4.763; 8 -4.763,4.128; 9 -4.763,3.493; 10 -4.763,2.857; 11 -4.763,2.223; 12 -4.763,1.587; 13 -4.763,0.953; 14 -4.763,0.318; 15 -4.763,-0.318; 16 -4.763,-0.953; 17 -4.763,-1.587; 18 -4.763,-2.223; 19 -4.763,-2.857; 20 -4.763,-3.493; 21 -4.763,-4.128; 22 -4.763,-4.763; 23 -4.763,-5.397; 24 -4.763,-6.032; 25 -4.763,-6.668; 26 -4.763,-7.303; 27 -4.763,-7.938; 28 -4.763,-8.572; 29 4.763,-8.572; 30 4.763,-7.938; 31 4.763,-7.303; 32 4.763,-6.668; 33 4.763,-6.032; 34 4.763,-5.397; 35 4.763,-4.763; 36 4.763,-4.128; 37 4.763,-3.493; 38 4.763,-2.857; 39 4.763,-2.223; 40 4.763,-1.587; 41 4.763,-0.953; 42 4.763,-0.318; 43 4.763,0.318; 44 4.763,0.953; 45 4.763,1.587; 46 4.763,2.223; 47 4.763,2.857; 48 4.763,3.493; 49 4.763,4.128; 50 4.763,4.763; 51 4.763,5.397; 52 4.763,6.032; 53 4.763,6.668; 54 4.763,7.303; 55 4.763,7.938; 56 4.763,8.572
2X1SMD = smd 0.89 x 2.54: 1 -0.05,-2.475; 2 -0.05,2.605
2X2SMD = smd 0.89 x 2.54: 1 -1.32,-2.475; 2 -1.32,2.605; 3 0.68,-2.475; 4 0.68,2.605
USB-MB-S = smd 2.5 x 0.5: D+ 2.5,0; D- 2.5,0.8; GND 2.5,-1.6; ID 2.5,-0.8; VBUS 2.5,1.6 | smd 2.5 x 2: P$1 -3,-4.5; P$2 -3,4.5; P$3 2.5,-4.4; P$4 2.5,4.5 | drill 0.9: P$5 0,2.2; P$6 0,-2.2

### Placement (x,y rotation side)
C1  32.45,47.62 90 top
C2  31.15,47.59 90 top
C3  24.89,41.47 270 bottom
C4  21.15,41.24 180 top
C5  21.15,37.85 180 top
C6  24.57,39.21 180 bottom
C7  24.54,36.26 180 bottom
C8  25.15,33.56 90 bottom
C9  30,33.56 90 bottom
C10  32.26,38 270 bottom
C11  35.12,40.29 0 top
C12  35.12,41.53 0 top
C13  35.34,45.47 90 top
C14  31.34,40.93 90 bottom
C15  28.29,40.1 90 bottom
C16  30.16,40.93 90 bottom
C17  26.1,41.47 90 bottom
C18  65.56,66.07 0 top
C19  60.17,66.07 180 top
C20  50.32,66.01 0 top
C21  44.99,66.01 180 top
C22  24.54,65.91 180 top
C23  29.78,65.91 0 top
C24  61.98,56.26 0 top
C25  29.05,52.67 90 top
C26  50.7,31.94 270 bottom
C27  59.37,25.56 90 bottom
C28  63.31,25.59 90 bottom
C29  57.34,42.23 0 bottom
C30  66.61,32.48 90 bottom
C31  51.59,34.89 180 bottom
C32  51.66,28.92 180 bottom
C33  52.45,25.05 90 bottom
C34  57.18,25.56 90 bottom
C35  50.77,41.85 0 bottom
C36  59.85,46.58 90 top
C37  63.66,41.69 0 bottom
C38  65.66,25.59 90 bottom
C39  26.07,49.02 90 bottom
C40  68.58,37.24 0 bottom
C41  77.47,49.91 180 top
C42  97.57,66.36 90 top
C43  106.52,18.1 180 bottom
C44  98.11,40.64 90 bottom
C45  93.34,40.64 90 bottom
C46  89.38,46.04 90 top
C47  97.47,49.05 0 top
C48  92.08,49.05 180 top
C49  94.77,28.1 90 bottom
C50  97,28.1 90 bottom
C51  99.54,28.1 90 bottom
C52  91.92,28.1 90 bottom
C53  88.11,28.1 90 bottom
C54  98.9,23.34 270 bottom
C55  88.74,23.65 270 bottom
C56  91.92,23.34 270 bottom
C57  66.2,29.05 0 bottom
C58  95.89,28.1 90 bottom
C59  98.11,28.1 90 bottom
C60  91.76,66.36 90 top
D3  102.43,57.88 270 top
IC1  26.07,71.5 0 top
IC2  46.48,71.56 0 top
IC3  61.69,71.56 0 top
IC4  85.88,48.26 180 top
IC5  93.5,54.93 0 top
J2  107.22,66.83 180 top
JP2  45.88,48.42 0 top
L1  24.77,44.13 90 bottom
L2  33.81,41.97 90 bottom
L3  26.07,44.89 90 bottom
LED1  73.56,45.72 270 top
LED2  71.28,66.2 90 top
LED3  73.69,56.64 90 top
LED4  71.12,56.64 90 top
LED5  68.48,56.67 90 top
Q3  95.73,38.89 0 top
QG1  60.33,52.64 180 top
R1  31.78,49.63 180 top
R2  21.15,39.08 180 top
R3  33.05,44.16 90 top
R4  34.19,44.16 90 top
R5  54.13,51.66 90 top
R6  55.66,51.66 90 top
R7  70.71,43.81 270 top
R8  72.04,43.91 90 top
R9  71.82,21.59 270 top
R10  69.44,21.59 270 top
R11  71.25,63.28 90 top
R12  73.69,53.63 90 top
R13  71.12,53.63 90 top
R14  68.48,53.63 90 top
R15  70.68,45.97 90 top
R16  87.95,39.05 90 top
R17  82.23,39.05 90 top
R18  101.12,22.23 180 bottom
R19  104.46,20.96 90 bottom
R20  105.73,20.96 90 bottom
R21  110.33,17.46 270 top
R22  106.68,23.18 270 top
S1  60.01,5.24 180 top
S2  80.55,59.98 180 top
S3  94.14,5.24 0 top
S4  111.6,48.42 180 top
T1  107.63,17.46 90 top
TP1  53.08,62.16 0 top
TP2  45.08,62.16 0 top
TP3  62.08,62.16 0 top
TP4  17.4,7.4 0 top
TP5  33.66,14.29 0 top
TP6  30.64,16.03 0 top
TP7  32.38,17.3 0 top
TP8  35.24,18.57 0 top
TP9  33.66,7.46 0 top
TP10  39.53,32.07 0 top
TP11  37.78,30.16 0 top
TP12  63.66,47.78 0 top
TP13  61.91,47.78 0 top
TP14  34.61,49.53 0 top
TP15  81.12,32.07 0 top
U$1  28.15,37.05 0 top
U$2  58.58,33.18 90 top
U$3  31.78,52.17 270 top
U$4  9.68,31.12 270 top
U$5  9.68,57.15 270 top
U$6  93.66,44.93 270 top
U$7  77.31,44.45 0 top
U$8  94.14,25.56 270 top
U$9  85.09,53.5 270 top
U$10  85.41,40.16 0 top
X1  111.92,26.83 180 top

### Tracks (layer width: path | path; a pad name or v marks a point on that pad's centre or on a via)
CS
  Top 0.254: U$2.10 54.33,18.2 52.86,16.73 32.96,16.73 TP7.TP 30.16,17.3 22.16,25.3 22.16,33.02 22.57,33.43 U$1.P$17
GND  (via drill 0.3, 0.3 pad 0.61, 0.5, 0.5 pad 0.61, 0.5 pad 1.02)
  Top 0.254: U$2.54 v68.07,32.93 v68.07,32.92 | U$2.130 48.8,31.43 v48.96,31.18 | U$2.136 47.04,28.43 v46.74,28.73 | U$2.144 47.23,24.43 v46.96,24.16 | U$2.3 50.83,23.37 v50.39,23.81 | U$2.13 55.83,23.48 v55.63,23.69 | U$2.113 48.97,39.93 v48.99,39.91 | U$2.108 49.26,43.93 v49.24,43.91 | C12.2 36.42,41.53 v36.45,41.5 | C11.2 36.42,40.29 v36.45,40.32 | U$1.P$19 v23.82,31.41 v23.81,31.4 | U$1.P$34 31.32,31.51 v31.21,31.34 | C25.1 29.19,52.17 U$3.2 31.69,52.17 v31.72,52.13 | R3.2 v33.05,45.69 | C13.2 34.5,46.12 v34.48,46.13 | U$2.96 55.83,42.78 v55.28,42.23 | U$2.25 61.83,23.55 v61.82,23.56 | U$2.60 v68.15,35.93 v68.14,35.94 | U$2.49 68.15,30.43 v68.1,30.48 | U$2.68 68.41,39.93 v68.14,39.66 | U$2.77 65.33,44.91 v65.34,44.93 | U$2.91 58.33,44.7 v58.1,45.02 | U$2.73 67.33,44.63 67.37,44.67 v67.91,44.67 | U$7.4 79.22,43.97 v79.18,44.01 | U$1.P$5 25.88,39.43 | 25.88,39.43 27.81,39.43 | 27.81,39.43 27.91,39.43 28.07,39.27 | 28.07,39.27 U$1.P$73_PAD | U$1.P$11 27.37,36.43 v27.45,36.35 v27.46,36.35 | C4.2 v19.88,41.24 | R2.2 v19.91,39.08 | C5.2 v19.91,37.85 | 25.88,37.66 25.88,39.43 | U$1.P$64 27.82,41.79 27.15,41.12 27.15,40.26 v27.11,40.23 | 28.07,39.27 28.07,39.35 28.32,39.61 | 28.32,39.61 27.99,39.61 27.81,39.43 | TP9.TP v31.75,7.46 | U$8.33 v88.11,21.91 | U$8.35 v89.38,21.91 | U$8.21 v90.01,29.21 | U$8.19 v91.28,31.43 | U$8.17 v92.55,31.43 | U$8.13 95.09,31.11 v94.77,31.43 | U$8.7 v98.9,31.43 | U$8.4 v100.81,31.43 | U$8.48 v97.63,19.84 | X1.GND 109.42,28.53 v109.38,28.57 | v89.53,3.02 89.91,3.02 S3.3 | v98.58,3.02 98.37,3.02 S3.4 | v55.4,3.02 55.78,3.02 S1.2 | v64.61,3.02 64.23,3.02 S1.1 | C41.1 78.68,49.91 v78.74,49.85 | LED1.C 73.56,47.56 v73.5,47.62
  Top 0.254: v91.76,71.28 C60.- | IC4.4 v83.98,49.37 | IC4.3 v85.25,49.37 | IC4.2 v86.52,49.37 | IC4.7 v86.52,47.15 | C46.2 v89.38,47.31 | S2.3 v84.93,62.23 | S2.4 v76.05,62.23 v76.04,62.23 | R21.1 109.03,18.11 T1.2 v109.06,18.41 | v11.59,36.83 11.27,36.83 11.11,36.67 11.11,36.83 v11.59,36.83 | v11.59,36.83 12.22,36.83 | U$4.6 10.97,34.78 10.95,34.77 v12.38,34.77 | v11.59,36.83 v12.38,36.83 11.7,36.83 U$4.4 | v11.59,32.86 v12.38,32.86 11.73,32.86 U$4.8 | U$4.10 11.6,30.78 v11.59,30.8 | U$4.12 v11.59,28.73 | v11.59,50.8 11.63,50.8 U$5.16 | U$5.14 12.34,52.82 v12.38,52.86 | v11.59,54.77 11.6,54.77 U$5.12 | v11.59,56.83 11.64,56.83 U$5.10 | v11.59,58.74 11.59,58.75 U$5.8 | 28.32,39.61 28.32,38.48 28.26,38.42 27.62,38.42 v27.46,38.26 | R11.1 71.25,61.79 v71.28,61.75
  Top 0.406: IC2.1 43.49,68.41 C21.- 42.39,66.01 v42.35,66.04 | C18.- 68.23,66.07 v68.26,66.04 | C22.- 21.84,65.91 v21.81,65.94 | QG1.2 v57.33,55.74 v57.34,55.75 | C24.1 60.55,56.26 v60.52,56.23 | C36.2 v59.85,48.36 | C48.- 90.57,50.09 91.12,50.64 91.12,51.66 IC5.1 91.28,51.74 v91.28,51.43 | C47.- v99.22,49.05
  Top 0.61: IC1.1 23.74,68.35 23.08,67.69 23.08,65.95 C22.- | C23.- v32.61,65.91 | IC3.1 59.43,66.83 C19.- 57.53,66.07 v57.5,66.1 | C20.- 53.05,66.01 v53.12,65.94 | C42.- v98.68,71.25 v97.6,71.25 v96.58,71.25
  Bottom 0.254: v68.07,32.92 66.61,32.92 C30.2 | 50.26,31.43 50.52,31.18 | v48.96,31.18 50.52,31.18 | 50.52,31.18 C26.2 | C29.2 v55.28,42.23 | C9.2 C8.2 25.24,34.3 v25.88,34.42 | v27.46,36.35 v27.46,38.26 | v27.46,38.26 27.46,39.59 | 27.46,39.59 v27.11,40.23 | v25.56,40.16 25.53,40.16 | C17.1 25.56,40.82 25.56,40.2 25.53,40.16 | 25.22,40.16 25.53,40.16 | v29.37,38.26 29.37,39.61 | v27.46,34.45 v27.46,36.35 | v25.56,36.35 v27.46,36.35 | v27.46,38.26 v25.56,38.26 25.56,38.88 C6.2 | v29.37,36.35 v29.37,34.45 29.97,35.08 30,35.05 C9.2 | C9.2 31.03,34.21 32.29,35.46 32.29,36.39 | 32.29,36.39 32.29,37.32 C10.2 | v31.11,36.35 32.26,36.35 32.29,36.39 | C15.1 27.61,39.58 27.46,39.59
  Bottom 0.406: JP2.5 49.69,46.77 50.67,45.78 50.67,44.77 U$2.108 49.26,43.93 v49.24,43.91 | C16.1 29.48,40.28 v29.37,40.16 29.37,39.61
  Bottom 0.813: C6.2 25.22,40.67 25.08,40.67 | 29.4,40.07 29.4,39.45 C15.1 27.16,39.45 26.23,40.39 | C14.1 31.34,40.07 30.89,39.62 30.8,39.62 29.43,38.26
  other vias: 31.12,34.45 23.81,67.94 23.81,68.9 44.29,67.94 44.29,68.9 59.37,68.9 59.37,67.94 31.12,38.26 12.38,50.8 12.38,54.77 12.38,56.83 11.59,52.86 12.38,58.74 12.38,30.8 12.38,28.73 11.59,34.77 108.58,31.43 109.38,31.43 110.17,31.43 114.14,31.43 114.94,31.43 115.73,31.43 108.58,22.54 109.38,22.54 110.17,22.54 114.14,22.54 114.94,22.54 115.73,22.54 108.58,28.58 110.17,28.58 90.17,49.05 91.28,52.23 90.8,71.28 92.71,71.28
  pour Bottom: 26.35,34.29 24.13,34.29 25.08,35.88 26.51,35.88 26.35,35.72
  pour Bottom: 0.16,81.44 0.16,0.16 117.63,0.16 117.63,81.44
N$1
  Top 0.254: U$2.71 70.54,41.43 70.71,41.59 R7.2 72.2,43.16 R8.1
N$2
  Top 0.254: U$2.93 57.33,50.3 QG1.3 57.06,51.01 R6.1
N$3
  Top 0.254: R8.2 73.45,44.56 LED1.A
N$4  (via drill 0.3 pad 0.61)
  Top 0.254: U$2.107 50.33,44.95 49.97,45.31 48.29,45.31 v48.26,45.28
  Bottom 0.254: v48.26,45.28 41.24,45.28 39.56,46.96 39.56,48.39 JP2.1
N$5  (via drill 0.3 pad 0.61)
  Top 0.254: U$2.106 50.83,45.37 50.07,46.13 v49.05,46.13
  Bottom 0.254: v49.05,46.13 45.24,46.13 44.61,46.77 JP2.3
N$6
  Top 0.254: U$2.109 47.35,41.93 47.15,42.13 JP2.4
N$7
  Top 0.254: U$2.110 46.71,41.43 45.94,42.2 45.94,44.77 44.77,45.94 42.83,45.94 42.07,46.7 JP2.2
N$8  (via drill 0.3 pad 0.61, 0.5 pad 1.02)
  Top 0.254: U$2.37 69.33,22.35 R10.1 69.55,22.35 v70.36,22.35 | v65.5,7.52 64.24,7.52 S1.3
  Bottom 0.254: v65.5,7.52 65.69,7.56 70.77,12.64 70.77,21.94 v70.36,22.35
N$9
  Top 0.254: U$1.P$3 23.06,40.42 17.78,40.42 17.65,40.29 15.14,37.78 9.21,37.78 8.21,36.78 U$4.3
N$10
  Top 0.254: U$1.P$4 23.08,39.91 18.95,39.91 14.76,35.72 9.21,35.72 8.27,34.78 U$4.5
N$11
  Top 0.254: U$1.P$10 20.58,36.93 17.46,33.81 9.21,33.81 8.18,32.78 U$4.7
N$12
  Top 0.254: U$1.P$12 20.98,35.93 16.8,31.75 9.21,31.75 8.24,30.78 U$4.9
N$13  (via drill 0.3 pad 0.61)
  Top 0.254: U$1.P$9 23.72,37.43 v23.94,37.21
  Bottom 0.254: C7.1 23.81,36.28 23.81,36.39 23.97,36.54 23.97,37.18 v23.94,37.21 23.81,37.12
N$14
  Top 0.254: U$1.P$72 17.34,42.17 13.95,38.78 U$4.2
N$15
  Top 0.254: U$1.P$71 24.32,42.74 23.81,43.24 15.3,43.24 12.64,40.58 8.37,40.58 U$4.1
N$16
  Top 0.254: U$1.P$70 24.82,43.28 23.81,44.29 21.91,44.29 20.16,46.04 16.19,46.04 13.49,48.74 11.74,48.74 U$5.18
N$17
  Top 0.254: U$1.P$69 25.32,42.21 25.3,42.23 25.3,43.88 19.34,49.85 9.21,49.85 8.18,48.82 U$5.17
N$18
  Top 0.254: U$1.P$66 26.82,43.79 18.7,51.91 9.21,51.91 8.12,50.82 U$5.15
N$19
  Top 0.254: U$1.P$65 27.32,45.26 27.05,45.53 26.76,45.82 18.76,53.82 9.21,53.82 8.21,52.82 U$5.13
N$20
  Top 0.254: U$1.P$62 28.83,42.18 28.83,45.85 18.8,55.88 9.21,55.88 8.15,54.82 U$5.11
N$21
  Top 0.254: U$1.P$60 29.82,42.76 29.53,43.05 29.53,46.96 18.7,57.78 9.21,57.78 8.24,56.82 U$5.9
N$22
  Top 0.254: U$1.P$59 30.32,47.94 19.37,58.9 15.08,58.9 14.13,59.85 9.21,59.85 8.18,58.82 U$5.7
N$23
  Top 0.254: C1.2 32.45,49.61 R1.1 33.08,50.28 U$3.4
N$24
  Top 0.254: C2.2 31.15,49.61 R1.2 30.48,50.28 U$3.3
N$25
  Top 0.254: U$1.P$57 31.32,44.4 31.15,44.58 C2.1
N$26
  Top 0.254: R4.2 C13.1
N$27
  Top 0.254: U$1.P$56 31.82,44.49 31.94,44.61 31.94,45.88 32.45,46.39 C1.1
N$28
  Top 0.254: U$2.39 70.14,25.43 71.91,23.65 71.91,22.34 R9.1
N$29
  Top 0.254: U$1.P$13 21.49,35.43 19.49,33.43 19.49,31.84 17.49,29.84 9.21,29.84 8.15,28.78 U$4.11
N$31
  Top 0.254: U$1.P$6 21.95,38.93 R2.1
N$32
  Top 0.254: U$1.P$7 22.68,38.43 22.42,38.16 22.11,38.16 C5.1
N$33
  Top 0.254: U$1.P$2 22.11,40.93 C4.1
N$34  (via drill 0.3 pad 0.61)
  Top 0.254: U$1.P$55 32.32,41.53 v32.19,41.37
  Bottom 0.254: v32.19,41.37 31.42,41.37 C14.2
N$35  (via drill 0.3)
  Top 0.254: U$1.P$63 28.29,42.17 v28.29,41.24
  Bottom 0.254: v28.29,41.24 28.32,41.4 C15.2
N$36
  Top 0.254: U$1.P$54 33.08,43.49 R3.1 R4.1
N$37
  Top 0.254: U$1.P$53 33.5,40.93 33.85,41.27 34.21,41.27 C12.1
N$38
  Top 0.254: U$1.P$52 34.32,40.43 C11.1
N$39
  Top 0.254: R6.2 R5.2 53.45,52.99 34.61,52.99 | U$3.5 33.21,52.99 34.61,52.99 | TP14.TP 34.61,52.99
N$41
  Top 0.254: R5.1 54.25,51.01 54.23,50.99 54.23,49.91 56.32,47.82 U$2.95
N$42
  Top 0.254: U$2.82 62.83,46.48 63.66,47.31 TP12.TP
N$43
  Top 0.254: U$2.84 61.83,47.7 TP13.TP
N$45
  Top 0.813: S4.2 104.77,48.42 102.55,50.64 102.55,55.09 102.39,55.24 102.39,55.85 D3.A
N$46
  Top 0.254: 71.25,65.12 R11.2
  Top 0.406: 71.25,65.12 LED2.C
N$47
  Top 0.254: X1.D+ 95.73,26.83 93.82,28.73 U$8.15
N$48  (via drill 0.5 pad 1.02)
  Top 0.61: IC1.2 26.09,65.96 C22.+ 26.04,63.73 v25.97,63.66
  Bottom 0.254: 26.07,46.39 L3.2 | L2.2 28.14,42.82 27.46,43.5 27.46,45.08 26.83,45.72 26.09,45.72 L3.2 | L1.2 24.76,45.4 25.24,45.88 25.93,45.88 L3.2 | L3.2 C39.1
  Bottom 0.61: v25.97,63.66 25.69,63.66 23.94,61.91 23.94,48.51 24.42,48.04 26.03,48.04 C39.1
N$49
  Top 0.254: U$8.16 93.19,28.42 95.57,26.03 X1.D-
N$50
  Top 0.813: J2.3 104.22,64.69 106.52,62.39 S4.1
N$51  (via drill 0.3 pad 0.61)
  Top 0.254: U$2.38 69.94,24.93 70.45,24.42 v70.45,24 | v72.93,41.43 75.04,41.43 U$7.1
  Bottom 0.254: v72.93,41.43 72.9,41.4 70.93,41.4 70.45,40.93 70.48,40.89 70.48,39.08 71.72,37.85 71.72,30.04 70.45,28.77 v70.45,24
N$52  (via drill 0.3)
  Top 0.254: S3.2 99.72,7.49 104.62,12.38 v104.62,18.1 | U$8.49 98.27,18.73 v98.9,18.1
  Bottom 0.254: v104.62,18.1 v98.9,18.1 | R19.1 104.46,18.26 v104.62,18.1 | C43.1 v104.62,18.1
N$53
  Top 0.254: U$7.5 79.25,47.77 79.25,45.88 80.17,44.96 80.17,39.85 78.25,37.93 U$2.64
N$54  (via drill 0.3 pad 0.61)
  Top 0.254: v71.28,40.48 71.28,40.64 70.99,40.93 U$2.70 | U$7.6 v77.95,46.07
  Bottom 0.254: v77.95,46.07 77.95,42.07 76.36,40.48 v71.28,40.48
N$55
  Top 0.254: U$2.65 75.58,38.43 76.68,39.53 U$7.2
N$56
  Top 0.254: U$2.75 66.33,45.69 71.28,50.64 72.71,50.64 73.66,51.59 73.66,52.94 R12.1
N$57  (via drill 0.3)
  Top 0.254: U$8.22 89.38,31.43 v89.53,31.59 | v85.72,36.83 85.88,36.83 86.04,36.99 86.04,37.64 U$10.3 86.04,37.73 86.04,38.42 86.06,38.4 R16.1
  Bottom 0.254: v89.53,31.59 89.53,31.91 85.72,35.72 v85.72,36.83
N$58
  Top 0.254: IC4.5 83.98,42.88 U$10.2
N$59  (via drill 0.3)
  Top 0.254: U$8.51 99.54,21.59 v99.69,21.91
  Bottom 0.254: R18.1 100.01,22.22 v99.69,21.91
N$60
  Top 0.254: LED3.C R12.2
N$61
  Top 0.254: LED4.C R13.2
N$62
  Top 0.254: LED5.C R14.2
N$63
  Top 0.254: U$2.79 64.33,45.28 71.12,52.07 R13.1
N$64  (via drill 0.3)
  Top 0.254: U$8.11 96.36,31.43 v96.52,31.59
  Bottom 0.254: v96.52,31.59 96.52,32.07 98.27,33.81 98.27,38.13 Q3.2 98.14,39.48 C44.1
N$65
  Top 0.254: U$2.80 63.83,46.05 68.58,50.8 68.58,52.88 R14.1
N$66  (via drill 0.3)
  Top 0.254: U$8.12 95.73,31.43 v95.57,31.59
  Bottom 0.254: v95.57,31.59 95.57,36.04 93.34,38.26 93.34,38.86 Q3.1 93.31,39.48 C45.1
N$67
  Top 0.254: U$2.74 66.83,44.92 68.58,46.67 70.63,46.67 R15.2 70.64,46.66 70.64,48.58 71.91,49.85 73.5,49.85 75.88,52.23 75.88,57.26 S2.2
N$68  (via drill 0.3, 0.5)
  Top 0.254: U$8.34 v88.74,22.54 | U$8.39 v91.92,22.07 v91.92,29.21 | U$8.24 v88.11,29.21 88.9,28.42 91.12,28.42 v91.92,29.21 | v91.92,29.21 U$8.18 v91.92,32.38 | v99.85,31.75 99.54,31.43 U$8.6 v99.54,29.21 99.06,28.73 97,28.73 | U$8.14 94.46,29.37 v94.61,29.21 95.09,28.73 97,28.73 | U$8.10 v97,29.21 97,28.73 | U$8.50 v98.9,21.91 | R17.2 R16.2 89.39,39.7 89.53,39.85 | U$9.1 82.61,49.15 83.5,48.26 87.31,48.26 87.79,47.78 IC4.8 88.06,45.39 C46.1 90.34,45.39 90.96,44.77 90.96,42.86
  Top 0.406: v102.39,35.08 102.39,40.96 100.49,42.86 93.66,42.86 | U$6.2 93.66,42.86 | v89.53,38.1 89.53,39.85 89.53,41.91 90.49,42.86 90.96,42.86 93.66,42.86
  Bottom 0.254: v88.11,29.21 C53.2 | v91.92,29.21 C52.2 | v99.54,29.21 C51.2 | v94.61,29.21 94.61,28.91 C49.2 C58.2 | v97,29.21 C50.2 C59.2 | v88.74,22.54 C55.2 88.76,23.02 90.17,23.02 90.5,22.69 C56.2 | v91.92,22.07 C56.2 | C54.2 v98.9,21.91 | C54.2 98.89,22.7 91.93,22.7 C56.2 | C54.2 98.92,22.7 99.38,22.7 99.85,23.18 101.6,23.18 101.77,23 R18.2 103.84,22.22 R19.2 R20.2 | v99.85,31.75 99.85,32.54 v102.39,35.08
  Bottom 0.406: v91.92,32.38 91.92,36.83 90.65,38.1 v89.53,38.1
N$69
  Top 0.254: IC4.1 87.79,53.45 U$9.2
N$70
  Top 0.406: IC5.2 93.57,51.73 C48.+ 93.57,45.86 U$6.1
N$71
  Top 0.254: X1.VBUS 106.67,25.23 106.67,23.84 R22.1
N$72  (via drill 0.3)
  Top 0.254: U$8.23 88.74,31.27 v88.26,31.75 | R17.1 83.99,38.4 84.14,38.26 84.14,37.74 U$10.1 84.14,37.64 84.14,36.99 84.3,36.83 v84.45,36.83
  Bottom 0.254: v84.45,36.83 84.45,35.56 v88.26,31.75
N$73
  Top 0.254: IC4.6 85.25,43.61 U$10.4
N$74  (via drill 0.3)
  Top 0.254: U$8.41 93.19,22.22 93.5,22.54 104.3,22.54 105.73,21.11 v105.73,19.53 105.73,17.78 106.04,17.46 T1.3
  Bottom 0.254: R20.1 v105.73,19.53
N$75
  Top 0.254: R22.2 106.68,20.95 107.63,20 110.65,20 111.92,18.73 111.92,17.3 111.28,16.67 110.47,16.67 R21.2 109.03,16.81 T1.1
P14
  Top 0.254: U$2.14 56.33,14.74 54.45,12.86 28.1,12.86 16.08,24.88 11.75,24.88 U$4.16
P15
  Top 0.254: U$2.15 56.83,13.65 55.02,11.84 27.81,11.84 15.84,23.81 9.21,23.81 8.23,24.78 U$4.15
P16
  Top 0.254: U$2.16 57.34,22.42 57.34,12.48 55.56,10.7 27.62,10.7 15.44,22.88 11.75,22.88 U$4.18
P17
  Top 0.254: U$2.17 57.83,10.97 56.23,9.37 27.3,9.37 15.33,21.34 9.68,21.34 8.23,22.78 U$4.17
P21
  Top 0.254: U$2.21 59.83,11.61 61.12,10.32 98.74,10.32 102.71,14.29 U$8.56
P22
  Top 0.254: U$8.55 102.08,14.76 98.58,11.27 61.44,11.27 60.32,12.38 U$2.22
P23
  Top 0.254: U$8.54 101.44,15.24 98.42,12.22 62.07,12.22 60.83,13.47 U$2.23
P24
  Top 0.254: U$8.53 100.81,15.87 98.11,13.18 62.55,13.18 61.33,14.39 U$2.24
P26
  Top 0.254: U$2.26 62.33,14.98 63.18,14.13 98.11,14.13 100.17,16.19 U$8.52
P27
  Top 0.254: U$2.27 62.83,15.91 63.82,14.92 94.93,14.92 97,16.99 U$8.47
P29
  Top 0.254: U$2.29 63.83,16.5 64.61,15.72 94.61,15.72 96.36,17.46 U$8.46
P30
  Top 0.254: U$2.30 64.33,17.27 65.09,16.51 94.46,16.51 95.73,17.78 U$8.45
P32
  Top 0.254: U$2.32 65.33,17.86 65.88,17.3 94.3,17.3 95.09,18.1 U$8.44
P33
  Top 0.254: U$2.33 65.83,18.78 66.52,18.1 93.03,18.1 93.82,18.89 U$8.42
P34
  Top 0.254: U$2.34 66.33,19.71 67.15,18.89 90.96,18.89 91.28,19.21 U$8.38
P35
  Top 0.254: U$2.35 66.83,20.64 67.79,19.68 90.49,19.68 90.65,19.84 U$8.37
P40
  Top 0.254: U$8.29 75.88,20.8 70.75,25.93 U$2.40
P41
  Top 0.254: U$2.41 71.52,26.43 75.88,22.07 85.88,22.07 86.2,21.75 U$8.30
P43
  Top 0.254: U$8.31 86.84,22.22 86.2,22.86 76.2,22.86 71.63,27.43 U$2.43
P44
  Top 0.254: U$2.44 72.24,27.93 76.52,23.65 86.36,23.65 87.47,22.54 U$8.32
P45
  Top 0.254: U$2.45 73.01,28.43 76.83,24.61 87.79,24.61 90.01,22.38 U$8.36
P46
  Top 0.254: U$2.46 73.62,28.93 73.98,28.57 85.57,28.57 86.2,29.21 U$8.27
P47
  Top 0.254: U$2.47 83.72,29.43 84.61,30.32 U$8.28
P48
  Top 0.254: U$2.48 71.2,29.93 71.44,30.16 83.18,30.16 84.45,31.43 86.68,31.43 86.84,31.27 U$8.26
P50
  Top 0.254: U$2.50 83,30.93 84.14,32.07 86.68,32.07 87.47,31.27 U$8.25
P51
  Top 0.254: U$8.20 90.65,31.59 89.53,32.7 83.5,32.7 82.87,32.07 TP15.TP 71.28,32.07 70.64,31.43 U$2.51
P55
  Top 0.254: U$2.55 95.95,33.43 97.63,31.75 U$8.9
P56
  Top 0.254: U$2.56 96.25,33.93 98.27,31.91 U$8.8
P57
  Top 0.254: U$2.57 99.08,34.43 101.44,32.07 U$8.3
P58
  Top 0.254: U$2.58 99.69,34.93 102.08,32.54 U$8.2
P59
  Top 0.254: U$2.59 100.46,35.43 102.71,33.18 U$8.1
P100  (via drill 0.5)
  Top 0.254: U$2.100 53.83,49.45 52.01,51.28 v52.01,51.85 | v52.04,55.12 43.05,55.12 36.29,61.88 23.02,61.88 21.97,62.93 17.43,62.93 15.48,64.88 11.72,64.88 U$5.2
  Bottom 0.254: v52.01,51.85 v52.04,55.12
P101  (via drill 0.3, 0.5)
  Top 0.254: U$2.101 53.33,45.29 v53.02,45.59 | v38.83,56.64 38.83,56.93 34.77,60.99 22.57,60.99 21.65,61.91 17.14,61.91 15.08,63.82 9.11,63.82 8.2,64.88 6.64,64.88 U$5.1
  Bottom 0.254: v53.02,45.59 51.97,45.59 50.89,46.67 50.89,49.75 50.29,50.36 40,50.36 38.89,51.47 38.89,56.58 v38.83,56.64
P111  (via drill 0.5)
  Top 0.254: v37.24,56.67 37.21,56.71 37.21,57.21 34.61,59.82 22.42,59.82 21.15,61.09 16.73,61.09 14.94,62.88 11.72,62.88 U$5.4 | v37.27,51.15 37.27,47.69 39.5,45.47 39.5,43.21 41.75,40.96 47.8,40.96 U$2.111
  Bottom 0.254: v37.24,56.67 37.24,51.18 v37.27,51.15
P112  (via drill 0.5)
  Top 0.254: v35.85,51.12 35.97,50.99 35.97,47.75 38.26,45.47 38.26,43.37 41.2,40.43 U$2.112 | v35.75,56.71 35.75,57.25 34.13,58.86 22.1,58.86 20.73,60.23 16.29,60.23 14.6,61.91 9.08,61.91 8.11,62.88 6.64,62.88 U$5.3
  Bottom 0.254: v35.85,51.12 35.85,56.61 v35.75,56.71
RES
  Top 0.254: U$2.12 55.33,17.1 52.67,14.45 33.81,14.45 TP5.TP 30,14.29 20.8,23.49 20.8,33.27 21.95,34.43 U$1.P$15
SCK
  Top 0.254: U$1.P$16 22.31,33.93 21.53,33.15 21.53,24.19 29.69,16.03 TP6.TP 30.96,15.72 52.77,15.72 54.83,17.78 U$2.11
SD
  Top 0.254: U$1.P$18 23.08,25.5 30,18.57 TP8.TP 36.42,17.4 52.64,17.4 53.83,18.59 U$2.9 53.85,22.41
TRXCLK
  Top 0.254: U$2.133 38.02,29.93 TP11.TP 35.08,30.16 33.18,32.07 32.42,32.07 U$1.P$36
TRXD0
  Top 0.254: U$2.138 33.98,27.43 30.32,31.08 U$1.P$32
TRXD1
  Top 0.254: U$2.139 33.71,26.93 29.81,30.83 U$1.P$31
TRXD2
  Top 0.254: U$2.140 33.52,26.43 29.32,30.62 U$1.P$30
TRXD3
  Top 0.254: U$2.141 33.32,25.93 28.82,30.43 U$1.P$29
TRXD4
  Top 0.254: U$2.142 33.02,25.43 28.32,30.13 U$1.P$28
TRXD5
  Top 0.254: U$2.143 32.79,24.93 27.82,29.9 U$1.P$27 27.84,32.15
TRXD6
  Top 0.254: U$2.1 39.61,22.43 37.81,24.23 31.59,24.23 27.34,28.48 27.34,32.15 U$1.P$26
TRXD7
  Top 0.254: U$2.2 50.33,21.63 50.13,21.43 39.4,21.43 37.5,23.34 31.53,23.34 26.83,28.04 U$1.P$25
TRXD8
  Top 0.254: U$2.5 51.83,20.59 51.28,20.03 39.59,20.03 37.05,22.57 31.27,22.57 26.32,27.53 U$1.P$24
TRXD9
  Top 0.254: U$2.6 52.33,20.07 51.66,19.4 39.08,19.4 36.86,21.62 31.15,21.62 25.81,26.96 U$1.P$23
TRXD10
  Top 0.254: U$2.7 52.83,19.55 52.1,18.83 38.39,18.83 36.42,20.8 30.89,20.8 25.34,26.35 25.32,26.4 U$1.P$22 25.3,32.16
TRXD11
  Top 0.254: U$2.8 53.33,18.98 52.55,18.19 37.75,18.19 36.16,19.78 30.64,19.78 24.82,25.6 U$1.P$21
TRXIQ
  Top 0.254: U$2.137 44.62,27.93 44.13,28.42 35.15,28.42 31.82,31.74 U$1.P$35
TXCLK
  Top 0.254: U$1.P$37 39.53,32.93 | 39.53,32.93 41.68,32.93 44.18,30.43 U$2.132 47.81,30.45 | TP10.TP 39.53,32.93
TXD0
  Top 0.254: U$1.P$50 U$2.114
TXD1
  Top 0.254: U$2.115 U$1.P$49
TXD2
  Top 0.254: U$1.P$48 U$2.116
TXD3
  Top 0.254: U$1.P$47 U$2.117
TXD4
  Top 0.254: U$1.P$46 U$2.118
TXD5
  Top 0.254: U$1.P$45 U$2.119
TXD6
  Top 0.254: U$1.P$44 U$2.120
TXD7
  Top 0.254: U$2.121 U$1.P$43
TXD8
  Top 0.254: U$1.P$42 45.4,35.43 45.91,34.93 U$2.123
TXD9
  Top 0.254: U$1.P$41 45.14,34.93 45.64,34.43 U$2.124 47.81,34.45
TXD10
  Top 0.254: U$1.P$40 43.99,34.43 44.99,33.43 U$2.126
TXD11
  Top 0.254: U$1.P$39 43.6,33.93 44.61,32.92 U$2.127
TXIQ
  Top 0.254: U$1.P$38 42.07,33.43 44.57,30.93 U$2.131
VCC1.2  (via drill 0.3 pad 0.61, 0.5 pad 1.02)
  Top 0.254: U$2.19 58.83,23.72 | U$2.28 63.34,22.43 v63.34,23.46 63.25,23.56 63.25,24.42 62.99,24.67 58.96,24.67 58.83,24.8 | U$2.52 v68.07,31.93 v68.07,31.94 58.9,31.94 | U$2.128 48.65,32.43 v48.99,32.83 | 58.83,23.72 58.83,24.8 | 58.83,24.8 58.83,31.87 58.9,31.94 | 55.91,32.86 v51.88,32.86 | U$2.89 59.33,42.69 v59.31,42.67 59.34,42.64 59.34,41.24 57.37,39.27 v55.91,39.27 | 55.91,32.86 55.91,39.12 | 58.9,31.94 56.83,31.94 55.91,32.86 | v59.4,23.56 58.99,23.56 58.83,23.72
  Top 0.406: IC2.2 46.49,68.41 C21.+
  Top 0.61: C21.+ 46.49,64.4 v46.45,64.36 | v55.91,39.27 55.91,39.12
  Bottom 0.254: v63.34,23.46 63.31,23.46 C28.1 | v68.07,31.94 66.61,31.94 C30.1 | v48.99,32.83 50.29,32.83 C26.1 50.73,32.86 v51.88,32.86 | v59.31,42.67 58.73,42.67 C29.1 | C27.1 59.37,23.59 v59.4,23.56
  Bottom 0.61: v46.45,64.36 46.45,63.21 46.56,63.1 53.72,55.94 53.72,51.88 54.8,50.8 54.8,44.96 54.07,44.23 54.07,41.12 v55.91,39.27
  Bottom 0.813: TP2.TP 45.62,62.16 46.56,63.1
VCC3.3  (via drill 0.3, 0.3 pad 0.61, 0.5 pad 1.02)
  Top 0.254: U$2.122 49.6,35.43 | 49.6,35.43 49.69,35.34 49.69,34.7 | JP2.6 52.23,46.93 52.32,46.93 U$2.103 52.33,41.75 | U$2.135 49.21,28.93 | 49.21,28.93 49.66,28.93 v49.69,28.96 | v49.69,28.96 49.69,31.94 | 49.69,31.94 49.69,33.85 | 49.69,33.85 49.69,34.7 | U$2.129 49.68,31.93 49.69,31.94 | U$2.4 v51.33,24.07 | v49.12,34.73 49.66,34.73 49.69,34.7 | v49.69,28.96 49.69,25.71 v51.33,24.07 | U$2.76 65.83,43.12 | 65.83,43.12 65.83,42.91 65.85,42.89 v65.85,42.39 | v65.85,42.39 65.85,41.59 66.99,40.45 67.18,40.45 | 67.18,40.45 69.31,40.45 U$2.69 | 67.18,40.45 67.06,40.32 67.06,37.46 67.09,37.43 U$2.63 70.17,37.43 v70.48,37.12 | 59.69,45.02 60.61,45.02 60.83,44.8 U$2.86 60.83,43.22 61.12,42.93 65.64,42.93 65.83,43.12 | 59.69,45.02 58.99,45.02 58.83,44.86 U$2.90 | 52.33,41.75 52.33,40.52 49.59,37.78 49.59,35.43 49.6,35.43 | QG1.1 62.66,54.7 | U$3.1 29.26,53.11 C25.2 | U$2.20 59.33,21.46 58.32,21.46 U$2.18 | U$2.18 | U$2.18 58.32,23.3 58.04,23.59 57.82,23.59 v57.72,23.69 57.72,24.13 57.28,24.57 51.84,24.57 v51.33,24.07 | v52.86,41.85 52.42,41.85 52.33,41.75 | U$2.31 64.83,23.33 65.09,23.59 66.99,23.59 | 66.99,23.59 67.31,23.59 | 67.31,23.59 67.72,23.59 68.2,24.07 68.2,26.92 | 68.2,26.92 68.2,29.3 v68.07,29.43 | 68.2,26.92 U$2.42 | 67.31,23.59 67.33,23.57 U$2.36 67.34,22.42 67.34,21.75 68.15,20.94 R10.2 R9.2 | v66.87,24.61 66.87,23.72 66.99,23.59 | v70.39,32.45 69.35,32.45 U$2.53 | C36.1 59.85,45.18 59.69,45.02 | U$7.3 77.95,44.26 76.68,45.53 U$7.7 | U$7.8 U$7.7 | v65.85,42.39 67.47,42.39 69.55,44.46 R7.1 70.71,45.29 R15.1 | v49.69,28.96 49.24,28.96 49.21,28.93 | 49.69,33.85 49.59,33.94 49.58,33.93 U$2.125 | LED3.A LED4.A 68.52,57.69 LED5.A 66.68,57.72 66.58,57.63
  Top 0.254: C41.2 76.82,47.95 U$7.7
  Top 0.406: IC2.3 48.82,68.41 C20.+ | 62.66,54.7 62.66,56.22 C24.2 | 66.74,56.55 66.61,56.67 | QG1.1 64.64,54.54 64.64,54.55 64.64,50.74 QG1.4 | 62.61,56.28 66.44,56.28 66.61,56.45 | U$3.1 30.51,53.14 30.51,54.13 30.54,54.1 v49.63,54.1 | C41.2 76.82,50.78 77.47,51.43 77.95,51.43 78.74,52.23 78.74,58.74 77.47,60.01 66.74,60.01 66.58,59.85 | 65.34,64.13 65.28,64.07
  Top 0.61: IC3.2 61.72,66.12 C19.+ 61.59,66.07 61.59,64.07 | IC2.3 48.88,68.33 54.13,68.33 56.07,66.39 56.04,66.39 56.04,64.07 | 62.61,56.28 C24.2 | v66.61,51.69 66.61,56.45 66.61,56.67 66.58,56.71 66.58,57.63 66.58,59.85 66.58,62.77 65.28,64.07 62.01,64.07 | JP2.6 52.23,49.56 50.48,51.31 v50.48,51.43 | v50.48,56.64 50.48,58.1 50.96,58.58 53.5,58.58 56.04,61.12 56.04,64.07 | TP3.TP 62.08,64 62.01,64.07 | 62.01,64.07 61.59,64.07 | 61.59,64.07 56.04,64.07
  Bottom 0.254: C31.1 49.28,34.89 v49.12,34.73 | C33.1 51.36,24.1 v51.33,24.07 | v57.72,23.69 57.72,24.07 C34.1 | C35.1 v52.86,41.85 | C38.1 66.83,24.64 v66.87,24.61 | C32.1 49.72,28.92 v49.69,28.96 | C57.1 67.69,29.05 v68.07,29.43 69.91,29.43 70.48,30 70.48,32.35 v70.39,32.45 70.48,32.54 v70.48,37.11 v70.48,37.12 70.36,37.24 C40.1
  Bottom 0.406: v49.63,54.1 50.48,54.1 | C37.1 65.31,42.39 v65.85,42.39
  Bottom 0.61: v66.61,51.69 66.61,43.15 v65.85,42.39 | v50.48,51.43 50.48,54.1 v50.48,56.64
VCC5
  Top 0.406: LED2.A 71.28,70.96 71.34,71.02 | C47.+ 95.97,51.62 IC5.3
  Top 0.61: IC1.3 28.38,66.01 C23.+ | IC3.3 64,66.13 C18.+ | 2.6,26.92 2.63,26.89 | 2.9,60.82 2.6,61.12 | U$5.6 U$5.5 | U$4.13 U$4.14
  Top 0.813: 2.6,26.92 2.6,61.12 2.6,68.77 4.86,71.02 28.54,71.02 | 64.17,71.02 28.54,71.02 | IC1.3 28.38,70.86 28.54,71.02 | IC3.3 64,70.86 64.17,71.02 | 64.17,71.02 71.34,71.02 83.76,71.02 88.74,66.04 88.74,63.98 89.53,63.18 91.73,63.18 C60.+ C42.+ 97.59,63.18 98.11,63.18 | U$5.5 2.9,60.82 | U$4.13 2.74,26.78 2.63,26.89 | D3.C 102.43,61.09 100.33,63.18 98.11,63.18 | IC5.3 97.34,51.78 98.27,52.7 98.27,63.02 98.11,63.18
VCCA1  (via drill 0.3 pad 0.61)
  Top 0.254: U$1.P$1 23.69,41.43 v23.91,41.34 | v23.94,38.45 23.94,38.23 23.65,37.94 23.09,37.94 U$1.P$8
  Bottom 0.254: v23.91,41.34 23.84,41.59 | 24.45,41.91 23.84,41.91 23.81,41.88 23.81,41.31 v23.91,41.34 | 24.45,41.91 24.69,41.91 C3.1 | v23.94,38.45 23.88,39.32 C6.1 23.84,38.85 23.91,38.91 v23.91,41.34 | L1.1 24.76,42.23 24.45,41.91
VCCA2  (via drill 0.3 pad 0.61)
  Top 0.254: 30.82,32.81 v30.83,32.99 | v24.32,32.99 23.94,33.37 23.94,34.61 23.61,34.93 U$1.P$14 | v30.83,32.99 31.94,32.99 32.19,33.24 v32.23,39.37 32.26,39.4 32.26,39.88 32.31,39.93 U$1.P$51 | v30.83,32.99 v24.32,32.99 | U$1.P$33 v30.82,32.98 v30.83,32.99 | v24.32,32.99 U$1.P$20
  Bottom 0.254: 30.02,32.99 v30.83,32.99 30.75,32.91 C9.1 | v24.32,32.99 25.05,32.99 | 25.05,32.99 25.07,32.99 | 25.1,32.86 C8.1 | 25.22,32.99 C8.1 | C8.1 25.13,32.91 25.05,32.99 | L2.1 33.85,40.77 33.85,39.66 33.56,39.37 v32.23,39.37 32.27,39.26 C10.1
VCCA3  (via drill 0.3 pad 0.61)
  Top 0.254: U$1.P$67 26.32,42.74 v26.07,43.08 | U$1.P$61 29.32,41.58 v29.34,41.43 30.73,41.43 30.82,41.52 U$1.P$58
  Bottom 0.254: v26.07,43.08 26.07,42.15 C17.2 26.3,41.91 | C16.2 29.35,41.58 v29.34,41.43 29.34,41.69 28.83,42.2 26.07,42.2 v26.07,43.08 | v26.07,43.08 L3.1
(copper drawn outside any net)
  shapes: Top area x11

### Text on the board
tPlace: GND | +5V | PWR | 101 | 100 | 111 | SELECT | 112 | +5V | +5V | S1 | S3 | QN | +1.2V | GND | +3.3V | S2 | QP | CML | CLK2 | CLK1 | IP | TMS | TDI | TDO | TCK | GND | VCC | IN | 84 | 82 | DONE | CLKIN | TX | 1 | QP | QN | CML | TXCLK | IFCLK | IN | TRXCLK | IP | +5V | +5V | 15 | 14 | 17 | 16 | 1 | RX | CS | SDIO | SCK | RES | FPGA RECONF | USB RESET | GND | GND